# Altium project PAY_IF.PrjPcb (part 1 of 3)
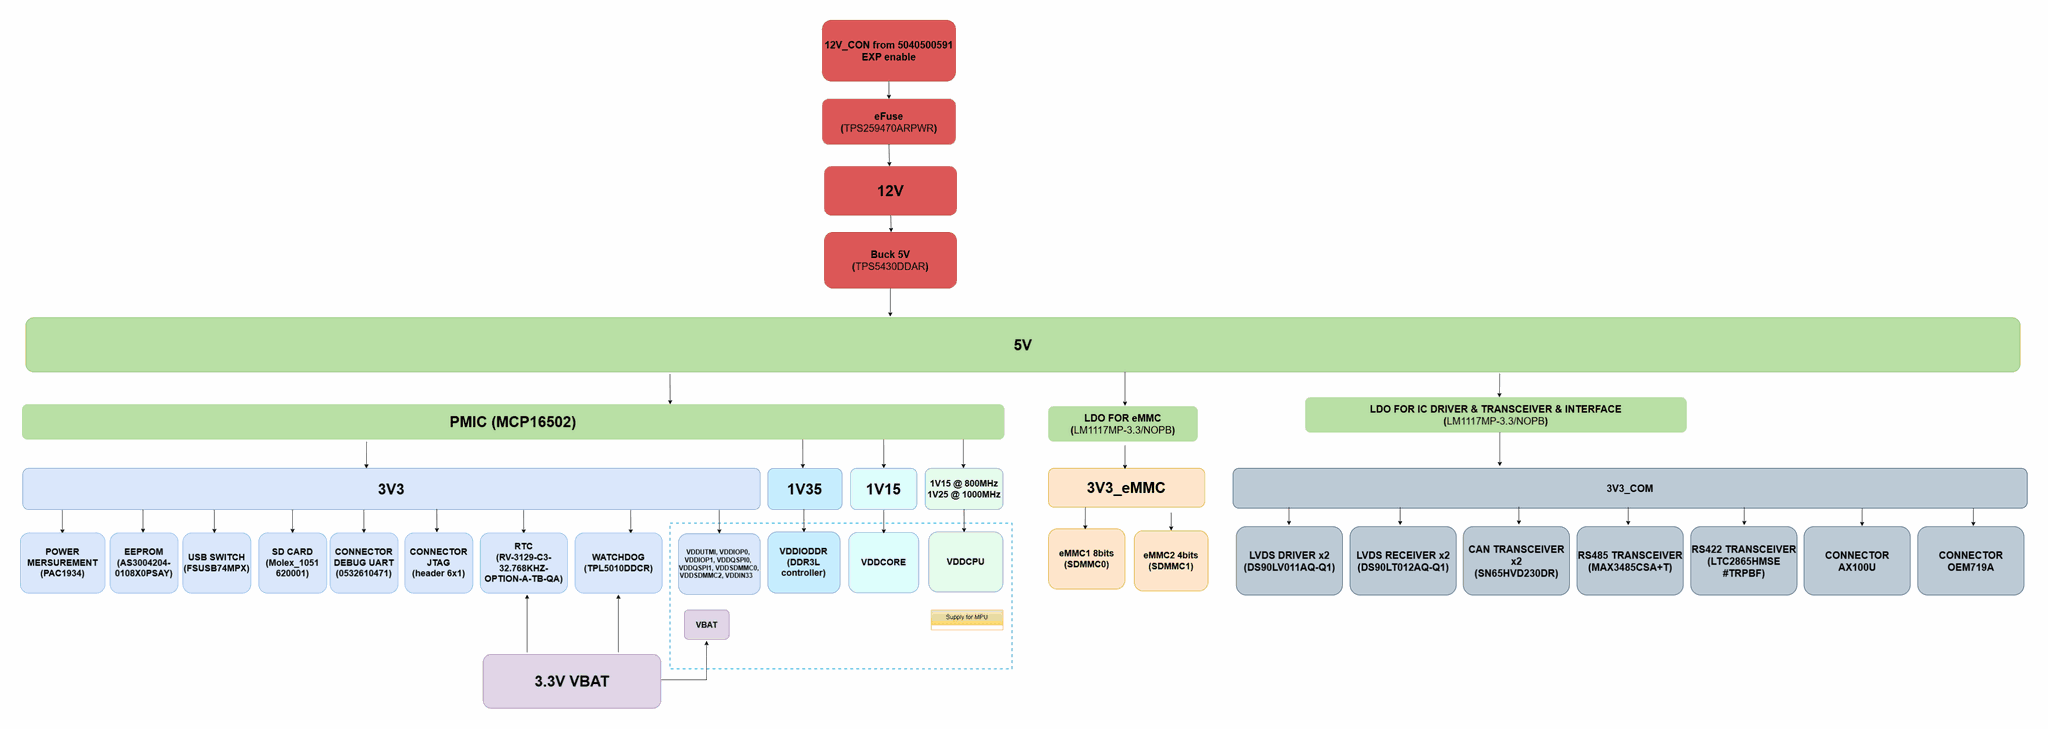
[diagram p0: PowerTree.SchDoc]
21 sheets, 538 parts. Net scope: flat (ports and power ports of the same name join across sheets).
Board file: BEE-1012 PAY-IF V1.0.0.PcbDoc
Sheets:
  PowerTree.SchDoc
  Power.SchDoc
  CONNECTOR_EXP.SchDoc
  CONNECTOR_INTERFACE.SchDoc
  SAMA7D65_PMIC.SchDoc
  SAMA7D65_MPU.SchDoc
  SAMA7D65_PIO.SchDoc
  SAMA7D65_DDR3L.SchDoc
  SDCARD.SchDoc
  eMMC.SchDoc
  EEPROM.SchDoc
  USB_SWITCH.SchDoc
  DEBUG_CONSOLE.SchDoc
  TEMP.SchDoc
  RTC.SchDoc
  WATCHDOG.SchDoc
  LVDS.SchDoc
  CAN_PHY.SchDoc
  RS422.SchDoc
  BUTTON_LED.SchDoc
  MOUNTING_HOLE.SchDoc

## Sheet PowerTree.SchDoc
size 420 x 297 mm; SheetNumber: 1; SheetTotal: 23

### Notes on the sheet
- Project:
- BEE-1012
- Sub-system:
- SATELLITE_EXP_CONTROLLER
- Design by:
- SANG HUYNH
- BAO BUI
- Sheet title:
- Sheet
- A3
- of
- Checked by:
- Approved by:
- VU PHAM
- Revision:
- Document No:
- Size:
- Date:

## Sheet Power.SchDoc
size A3; SheetNumber: 3; SheetTotal: 23
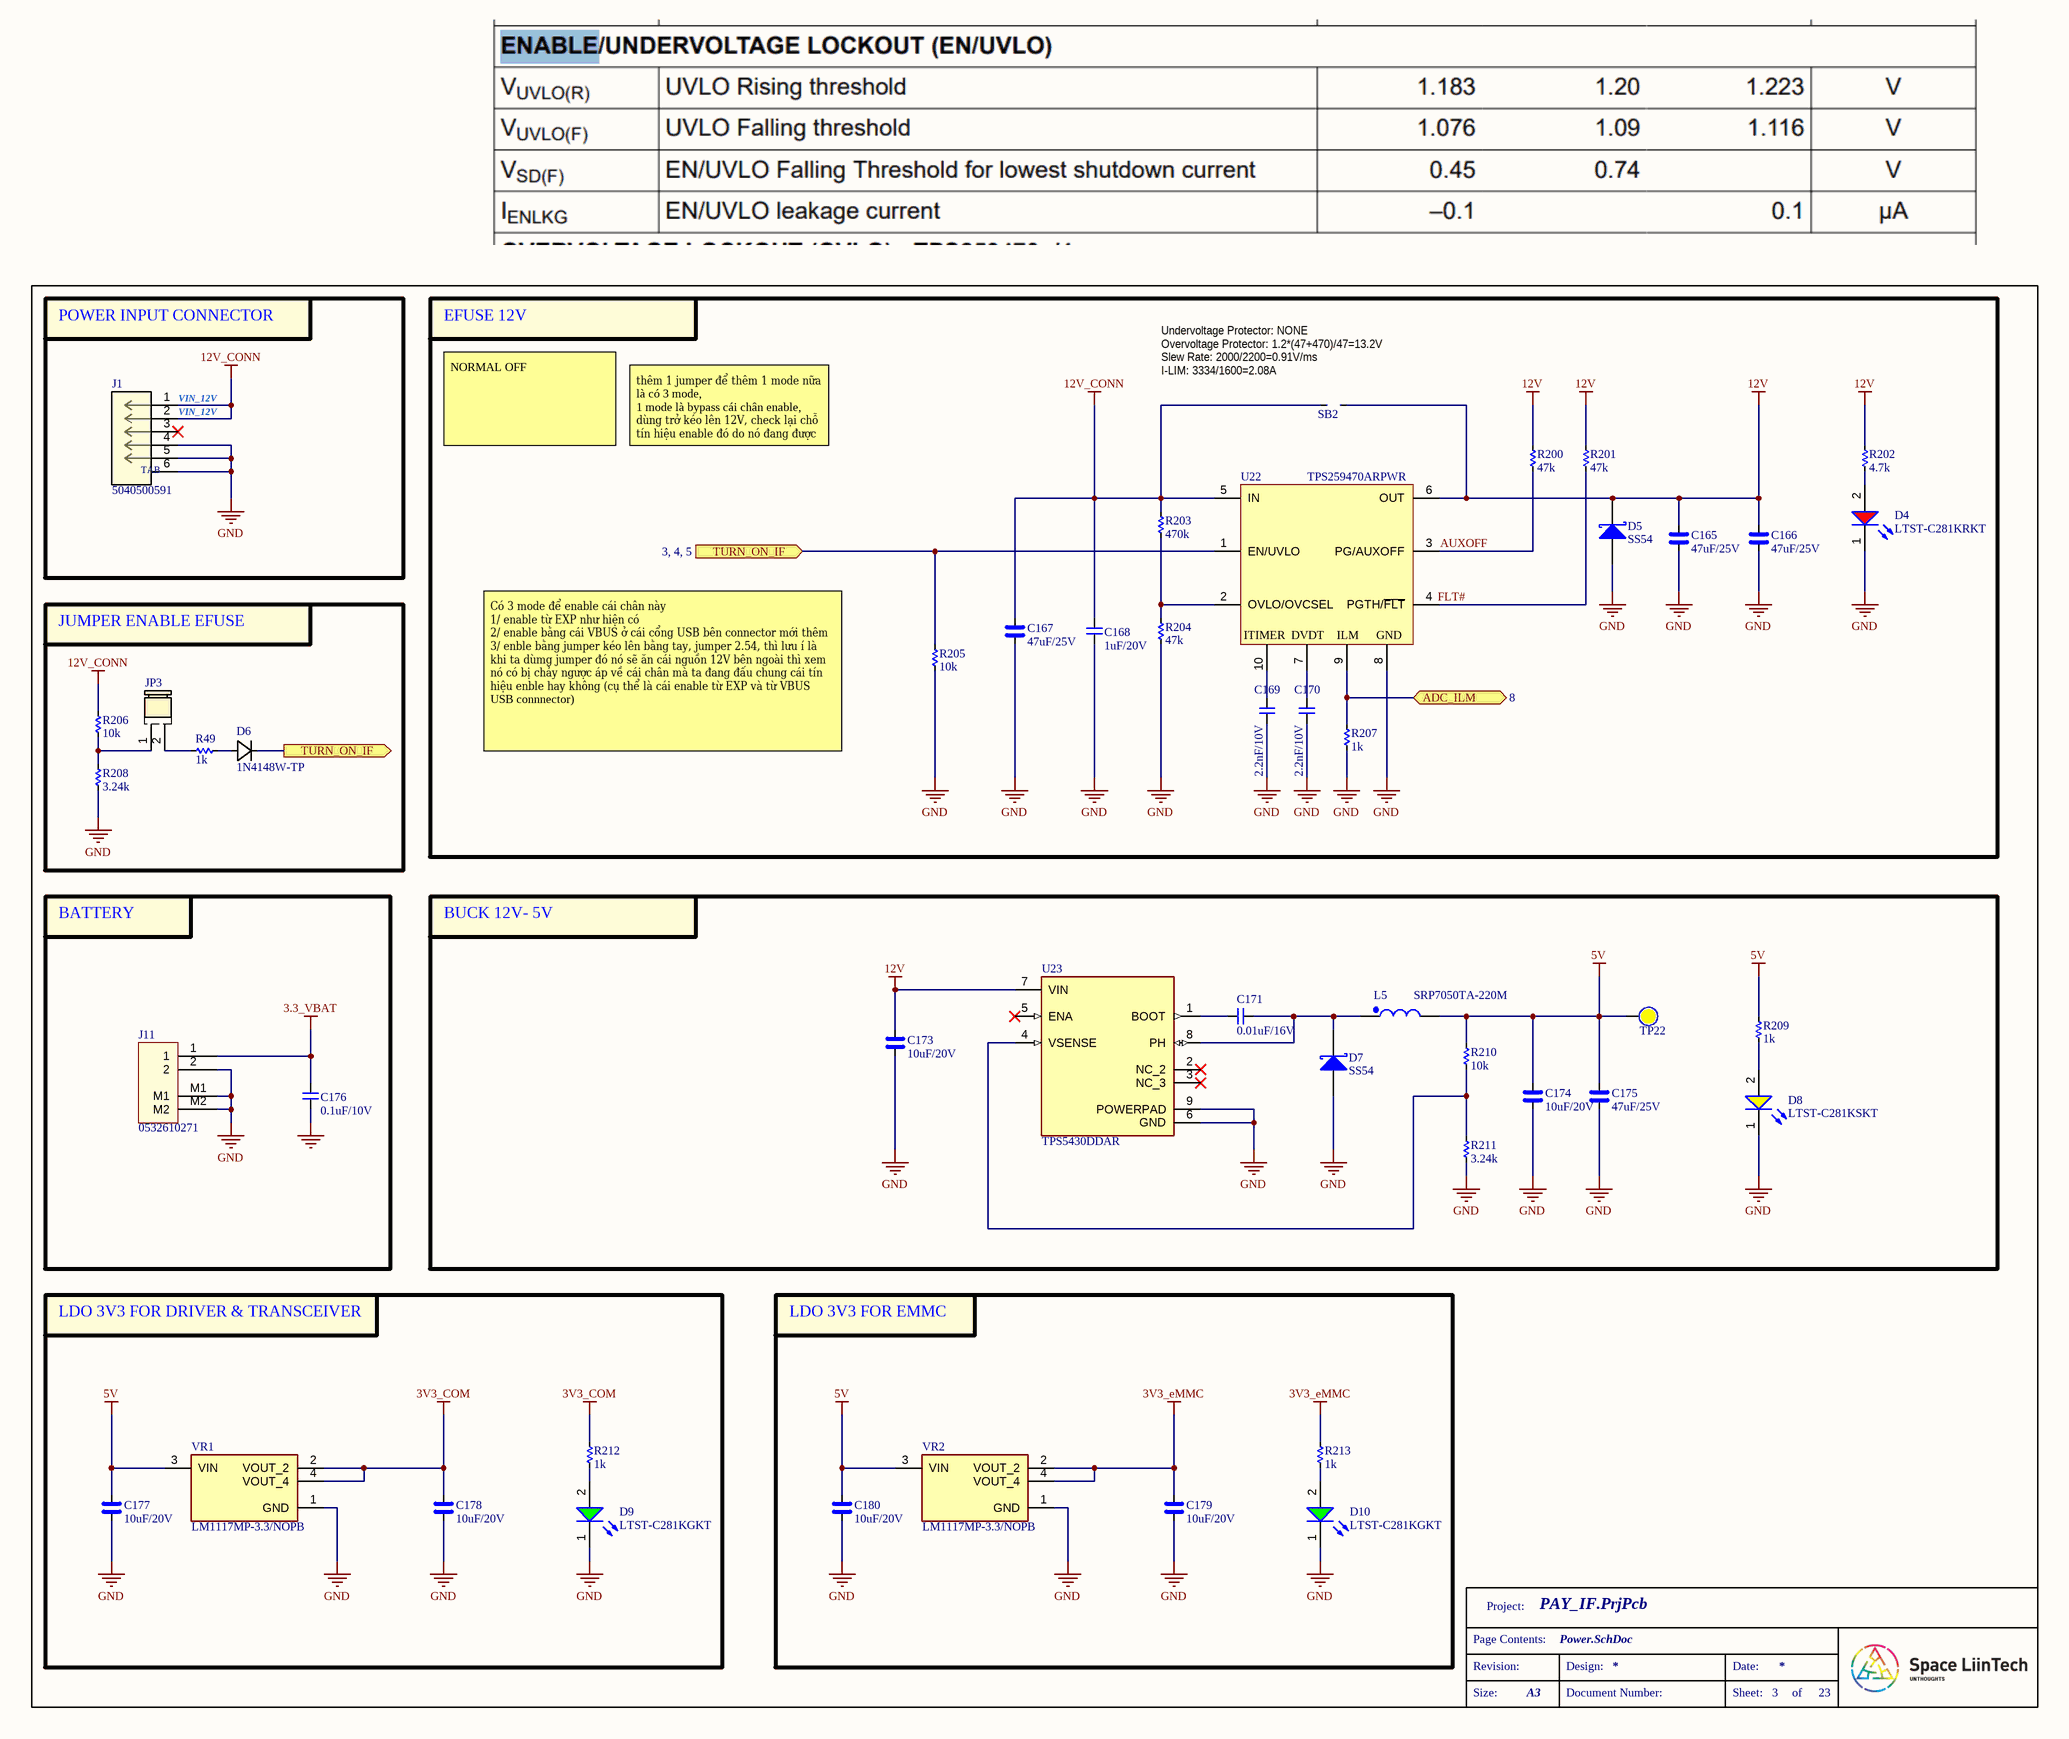
[diagram p1: Power.SchDoc]

### Parts
(Parts that share a designator on the sheet are numbered #1, #2 ... from top to bottom, then left to right.)
C165  47uF/25V  [CAP_C_3225X80]
C166  47uF/25V  [CAP_C_3225X80]
C167  47uF/25V  [CAP_C_3225X80]
C168  1uF/20V  [CAP_C_1005X50_L]
C169  2.2nF/10V  [CAP_C_1005X50_L]
C170  2.2nF/10V  [CAP_C_1005X50_L]
C171  0.01uF/16V  [CAP_C_1608X80_L]
C173  10uF/20V  [CAP_C_2012X110]
C174  10uF/20V  [CAP_C_2012X110]
C175  47uF/25V  [CAP_C_3225X80]
C176  0.1uF/10V  [CAP_C_1005X50_L]
C177  10uF/20V  [CAP_C_2012X110]
C178  10uF/20V  [CAP_C_2012X110]
C179  10uF/20V  [CAP_C_2012X110]
C180  10uF/20V  [CAP_C_2012X110]
D4  LTST-C281KRKT  [LED_0402]
D5  SS54  [DO-214AC_SMA]
D6#1  1N4148W-TP  [SOD123_MCC]
D7  SS54  [DO-214AC_SMA]
D8  LTST-C281KSKT  [LED_0402]
D9  LTST-C281KGKT  [LED_0402]
D10  LTST-C281KGKT  [LED_0402]
J1  5040500591  [5040500591]
J11#1  0532610271  [MOLEX_0532610271]
JP3  JUMPER_254P_NOPLACE  [JUMPER_254P_2X1_ANGLE]  (value not drawn)
L5  SRP7050TA-220M  [SRP7050TA-220M]
R49  1k  [RES_C_1005x30_L]
R200  47k  [RES_C_1005x30_L]
R201  47k  [RES_C_1005x30_L]
R202  4.7k  [RES_C_1005x30_L]
R203  470k  [RES_C_1005x30_L]
R204  47k  [RES_C_1005x30_L]
R205  10k  [RES_C_1005x30_L]
R206  10k  [RES_C_1005x30_L]
R207  1k  [RES_C_1005x30_L]
R208  3.24k  [RES_C_1005x30_L]
R209  1k  [RES_C_1005x30_L]
R210  10k  [RES_C_1005x30_L]
R211  3.24k  [RES_C_1005x30_L]
R212  1k  [RES_C_1005x30_L]
R213  1k  [RES_C_1005x30_L]
SB2  JUMPER  [JUMPER_1608]  (value not drawn)
TP22  (no value)  [Test point]  (no BOM)
U22  TPS259470ARPWR  [VQFN-HR-10]
U23  TPS5430DDAR  [CONV_TPS5430DDAR]
VR1  LM1117MP-3.3/NOPB  [VREG_LM1117MP-3.3/NOPB]
VR2  LM1117MP-3.3/NOPB  [VREG_LM1117MP-3.3/NOPB]

### Blocks framed on the sheet
POWER INPUT CONNECTOR: J1
EFUSE 12V: C165-C170 D4 D5 R200-R205 R207 SB2 U22
JUMPER ENABLE EFUSE: D6#1 JP3 R49 R206 R208
BATTERY: C176 J11#1
BUCK 12V- 5V: C171 C173-C175 D7 D8 L5 R209-R211 TP22 U23
LDO 3V3 FOR DRIVER & TRANSCEIVER: C177 C178 D9 R212 VR1
LDO 3V3 FOR EMMC: C179 C180 D10 R213 VR2

### Ports
ADC_ILM (bidir, see 8), TURN_ON_IF (in, see 3, 4, 5), TURN_ON_IF (out, see 3, 4, 5)

### Nets
3.3_VBAT: C176.1 J11#1.1
3V3_COM: C178.2 R212.2 VR1.2(VOUT_2) VR1.4(VOUT_4)
3V3_eMMC: C179.2 R213.2 VR2.2(VOUT_2) VR2.4(VOUT_4)
5V: C174.2 C175.2 C177.2 C180.2 L5.2 R209.2 R210.1 TP22.0 VR1.3(VIN) VR2.3(VIN)
12V: C165.2 C166.2 C173.2 D5.1(K) R200.2 R201.2 R202.2 SB2.2 U22.6(OUT) U23.7(VIN)
12V_CONN: C167.2 C168.2 J1.1 J1.2 R203.1 R206.2 SB2.1 U22.5(IN)
GND: C165.1 C166.1 C167.1 C168.1 C169.1 C170.1 C173.1 C174.1 C175.1 C176.2 C177.1 C178.1 C179.1 C180.1 D4.1(K) D5.2(A) D7.2(A) D8.1(K) D9.1(K) D10.1(K) J1.4 J1.5 J1.6 J11#1.2 J11#1.M1 J11#1.M2 R204.2 R205.2 R207.2 R208.2 R211.2 U22.8(GND) U23.6(GND) U23.9(POWERPAD) VR1.1(GND) VR2.1(GND)
AUXOFF: R200.1 U22.3(PG/AUXOFF)
FLT#: R201.1 U22.4(PGTH/~{FLT})
NetC169_2: C169.2 U22.10(ITIMER)
NetC170_2: C170.2 U22.7(DVDT)
NetC171_1: C171.1 D7.1(K) L5.1 U23.8(PH)
NetC171_2: C171.2 U23.1(BOOT)
NetD4_2: D4.2(A) R202.1
NetD6#1_1: D6#1.1 R205.1 U22.1(EN/UVLO) ; port TURN_ON_IF
NetD6#1_2: D6#1.2 R49.2
NetD8_2: D8.2(A) R209.1
NetD9_2: D9.2(A) R212.1
NetD10_2: D10.2(A) R213.1
NetJP3_1: JP3.1 R206.1 R208.1
NetJP3_2: JP3.2 R49.1
NetR88_2: R207.1 U22.9(ILM) ; port ADC_ILM
NetR203_2: R203.2 R204.1 U22.2(OVLO/OVCSEL)
NetR210_2: R210.2 R211.1 U23.4(VSENSE)

Not connected (* = marked no-connect by the designer): J1 3*; U23 2(NC_2)* 3(NC_3)* 5(ENA)*

### Notes on the sheet
- Undervoltage Protector: NONE
- Overvoltage Protector: 1.2*(47+470)/47=13.2V
- (near SB2) Slew Rate: 2000/2200=0.91V/ms
- (near J1) VIN_12V
- (near SB2) I-LIM: 3334/1600=2.08A
- NORMAL OFF
- thêm 1 jumper để thêm 1 mode nữa là có 3 mode,
  1 mode là bypass cái chân enable, dùng trở kéo lên 12V, check lại chỗ tín hiệu enable đó do nó đang được enable bởi EXP và cái VBUS bên connector
- Có 3 mode để enable cái chân này
  1/ enable từ EXP như hiện có
  2/ enable bằng cái VBUS ở cái cổng USB bên connector mới thêm
  3/ enble bằng jumper kéo lên bằng tay, jumper 2.54, thì lưu í là khi ta dùmg jumper đó nó sẽ ăn cái nguồn 12V bên ngoài thì xem nó có bị chảy ngược áp về cái chân mà ta đang đấu chung cái tín hiệu enble hay không (cụ thể là cái enable từ EXP và từ VBUS USB connnector)
- Project:
- Page Contents:
- Revision:
- Design:
- Date:
- Size:
- A3
- Document Number:
- Sheet:
- of
- (in symbol 5040500591) TAB

### Library data of the parts
C165-C167 C173-C175 C177-C180 = _CAP_C_High_2: CAP CHIP High Value
C168-C171 C176 = _CAP_C_2: CAP CHIP
D4 = LED_RED: LED RED CLEAR 0402 SMD
D5 D7 = SS54: DIODE SCHOTTKY 40V 5A SMA; MPN: SS34; Solder: SMT; Value: SS34; MFR: *
D6#1 = 1N4148W-TP: Description; Manufacturer_Name: MCC; Copyright: Copyright (C) 2026 Ultra Librarian. All rights reserved.; Manufacturer_Part_Number: 1N4148W-TP
D8 = LED_YELLOW: LED YELLOW CLEAR 0402 SMD
D9 D10 = LED_GREEN: LED GREEN CLEAR 0402 SMD
J1 = 5040500591: 1.50mm Pitch, Pico-Lock PCB Header, Single Row, Right-Angle, Surface Mount, Gold (Au) Plating, Positive Lock, 5 Circuits, Tape and Reel; Manufacturer_Name: Molex Connector Corporation; Copyright: Copyright (C) 2025 Ultra Librarian. All rights reserved.; Manufacturer_Part_Number: 5040500591; RefDes: RefDes; Type: Type
J11#1 = Header 2x1_2M
L5 = _IND: FIXED IND 22UH 2.5A 170 MOHM SMD
R49 R200-R213 = _RES_B_2: RES
TP22 = Test Point: Solder: NF
U23 = TPS5430DDAR: 5.5V to 36V Input, 3A, 500kHz Step-Down Converter; MF: Texas Instruments; Package: HSOIC-8 Texas Instruments; Check_prices: https://www.snapeda.com/parts/TPS5430DDAR/Texas+Instruments/view-part/?ref=eda; Value: *; Purchase-URL: https://pricing.snapeda.com/search/part/TPS5430DDAR/?ref=eda; Availability: In Stock; SnapEDA_Link: https://www.snapeda.com/parts/TPS5430DDAR/Texas+Instruments/view-part/?ref=snap; MP: TPS5430DDAR; Price: None
VR1 VR2 = LM1117MP-3.3/NOPB: 800-mA 15-V linear voltage regulator; MF: Texas Instruments; SnapEDA_Link: https://www.snapeda.com/parts/LM1117MP-3.3/NOPB/Texas+Instruments/view-part/?ref=snap; Package: SOT-223-4 Texas Instruments; Value: *; MP: LM1117MP-3.3/NOPB; Check_prices: https://www.snapeda.com/parts/LM1117MP-3.3/NOPB/Texas+Instruments/view-part/?ref=eda

## Sheet CONNECTOR_EXP.SchDoc
size A3; SheetNumber: 4; SheetTotal: 23
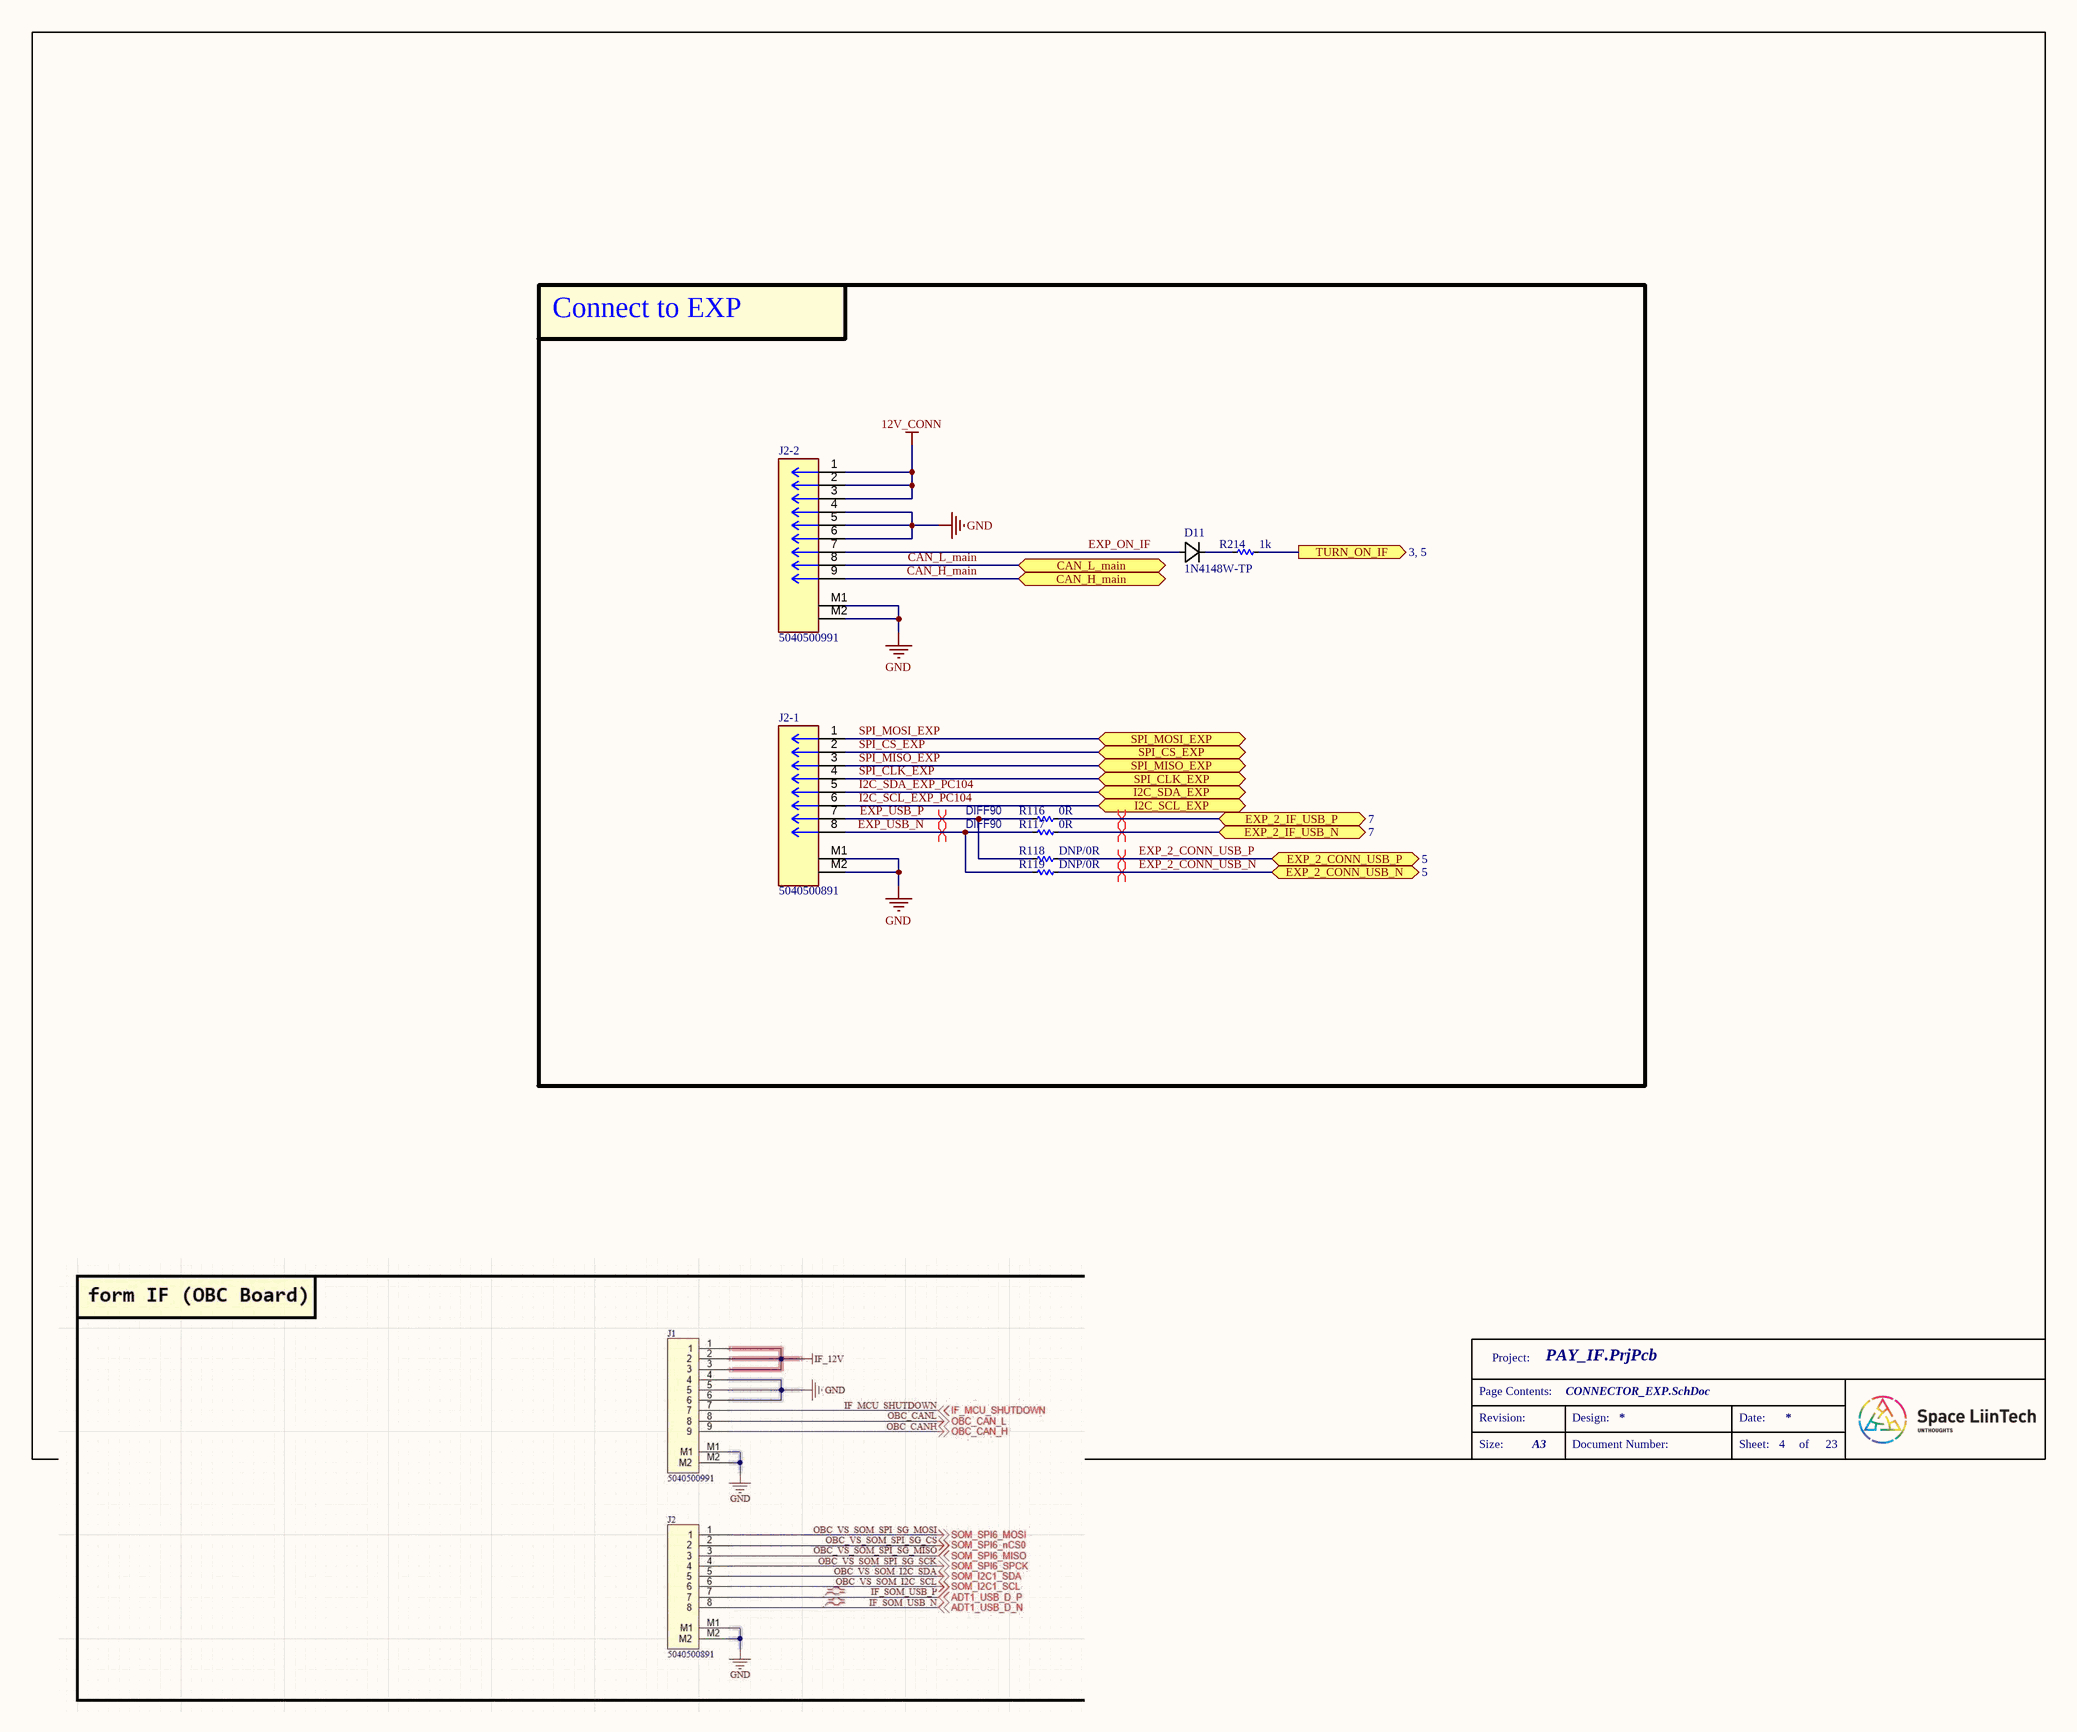
[diagram p2: CONNECTOR_EXP.SchDoc]

### Parts
D11  1N4148W-TP  [SOD123_MCC]
J2-1  5040500891  [MOLEX_5040500891]
J2-2  5040500991  [MOLEX_5040500991]
R116  0R  [RES_C_0603X30]
R117  0R  [RES_C_0603X30]
R118  DNP/0R  [RES_C_0603X30]
R119  DNP/0R  [RES_C_0603X30]
R214  1k  [RES_C_1005x30_L]

### Blocks framed on the sheet
Connect to EXP: D11 J2-1 J2-2 R116-R119 R214

### Ports
CAN_H_main (bidir, see 5, 19), CAN_L_main (bidir, see 5, 19), EXP_2_CONN_USB_N (bidir, see 5), EXP_2_CONN_USB_P (bidir, see 5), EXP_2_IF_USB_N (bidir, see 7), EXP_2_IF_USB_P (bidir, see 7), I2C_SCL_EXP (bidir, see 5, 8), I2C_SDA_EXP (bidir, see 5, 8), SPI_CLK_EXP (bidir, see 5), SPI_CS_EXP (bidir, see 5), SPI_MISO_EXP (bidir, see 5), SPI_MOSI_EXP (bidir, see 5), TURN_ON_IF (out, see 3, 5)

### Nets
12V_CONN: J2-2.1 J2-2.2 J2-2.3
GND: J2-1.M1 J2-1.M2 J2-2.4 J2-2.5 J2-2.6 J2-2.M1 J2-2.M2
CAN_H_main: J2-2.9 ; port CAN_H_main  [project net CAN_A7_H]
CAN_L_main: J2-2.8 ; port CAN_L_main  [project net CAN_A7_L]
EXP_2_CONN_USB_N: R119.2 ; port EXP_2_CONN_USB_N
EXP_2_CONN_USB_P: R118.2 ; port EXP_2_CONN_USB_P
EXP_2_IF_USB_N: R117.2 ; port EXP_2_IF_USB_N
EXP_2_IF_USB_P: R116.2 ; port EXP_2_IF_USB_P
EXP_ON_IF: D11.2 J2-2.7
EXP_USB_N: J2-1.8 R117.1 R119.1
EXP_USB_P: J2-1.7 R116.1 R118.1
I2C_SCL_EXP_PC104: J2-1.6 ; port I2C_SCL_EXP  [project net FLEXCOM1_I2C_SCL]
I2C_SDA_EXP_PC104: J2-1.5 ; port I2C_SDA_EXP  [project net FLEXCOM1_I2C_SDA]
SPI_CLK_EXP: J2-1.4 ; port SPI_CLK_EXP
SPI_CS_EXP: J2-1.2 ; port SPI_CS_EXP
SPI_MISO_EXP: J2-1.3 ; port SPI_MISO_EXP
SPI_MOSI_EXP: J2-1.1 ; port SPI_MOSI_EXP
NetD6#1_1: R214.2 ; port TURN_ON_IF
NetD11_1: D11.1 R214.1

### Layout directives
differential pair; differential pair class DIFF90; net class DIFF90; rule Matched Net Lengths [Tolerance = 4mil]: EXP_2_CONN_USB_N, EXP_2_CONN_USB_P, EXP_2_IF_USB_N, EXP_2_IF_USB_P, EXP_USB_N, EXP_USB_P

### Notes on the sheet
- Project:
- Page Contents:
- Revision:
- Design:
- Date:
- Size:
- A3
- Document Number:
- Sheet:
- of

### Library data of the parts
D11 = 1N4148W-TP: Description; Manufacturer_Name: MCC; Copyright: Copyright (C) 2026 Ultra Librarian. All rights reserved.; Manufacturer_Part_Number: 1N4148W-TP
J2-1 = 5040500891: Connector Header Surface Mount, Right Angle 8 position 0.059" (1.50mm)`
J2-2 = 5040500991: Connector Header Surface Mount, Right Angle 9 position 0.059" (1.50mm)
R116-R119 R214 = _RES_B_2: RES

## Sheet CONNECTOR_INTERFACE.SchDoc
size A3; SheetNumber: 5; SheetTotal: 23
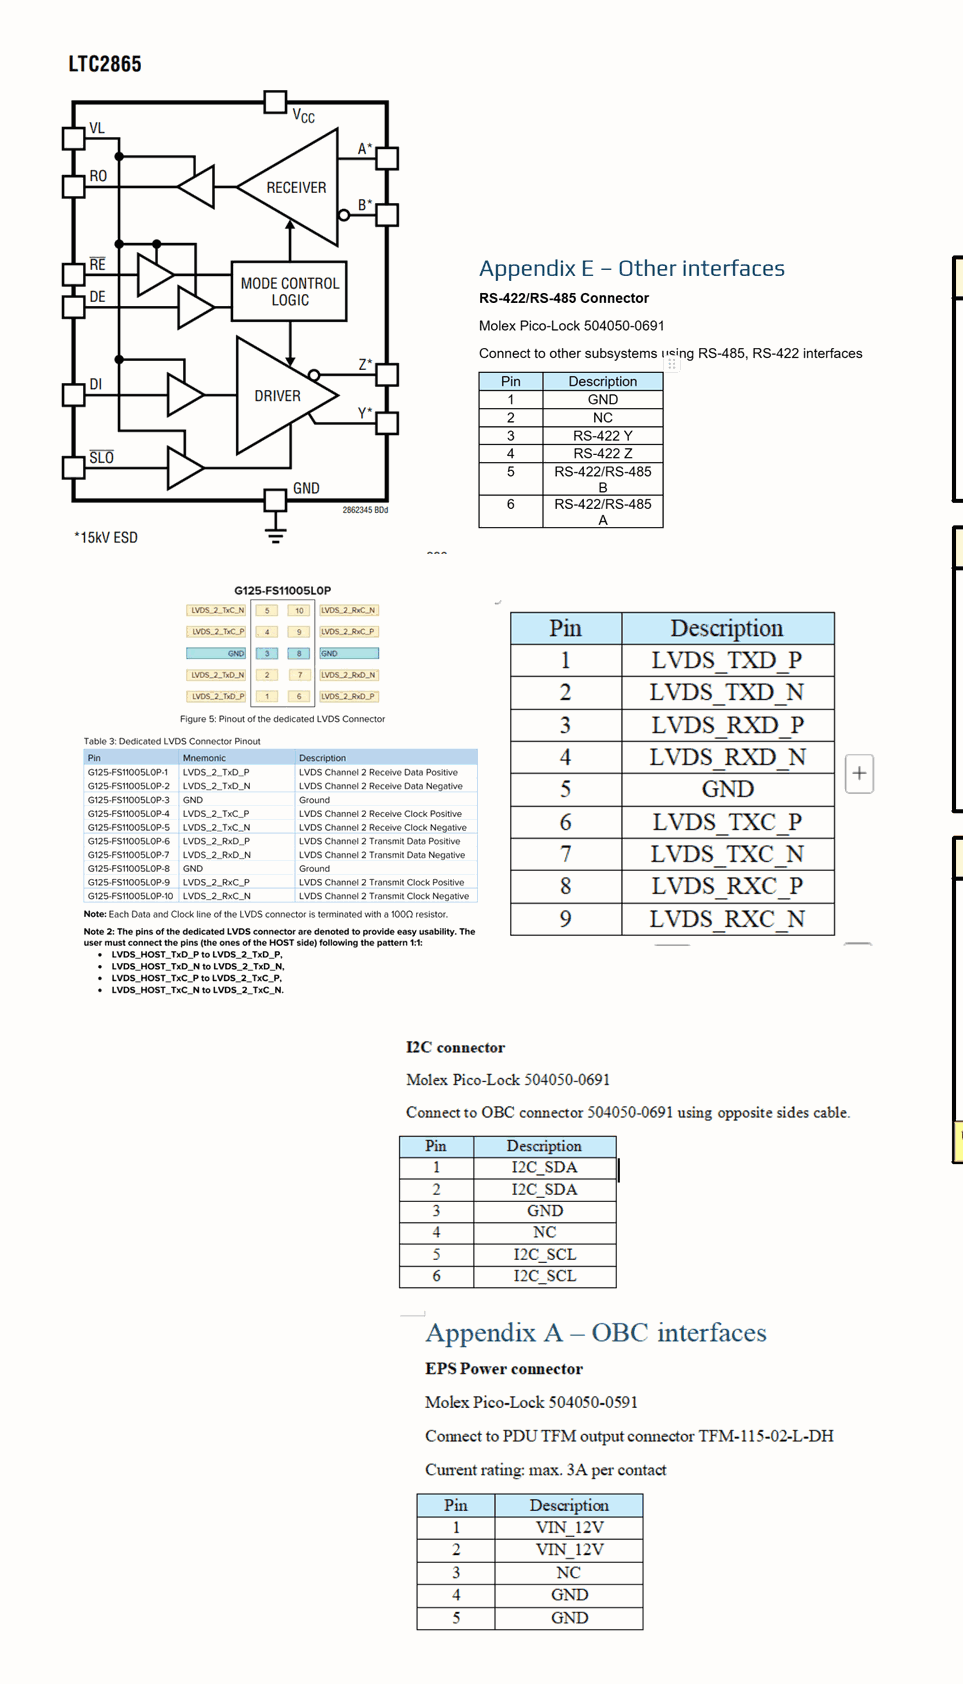
[diagram p3: CONNECTOR_INTERFACE.SchDoc, left]
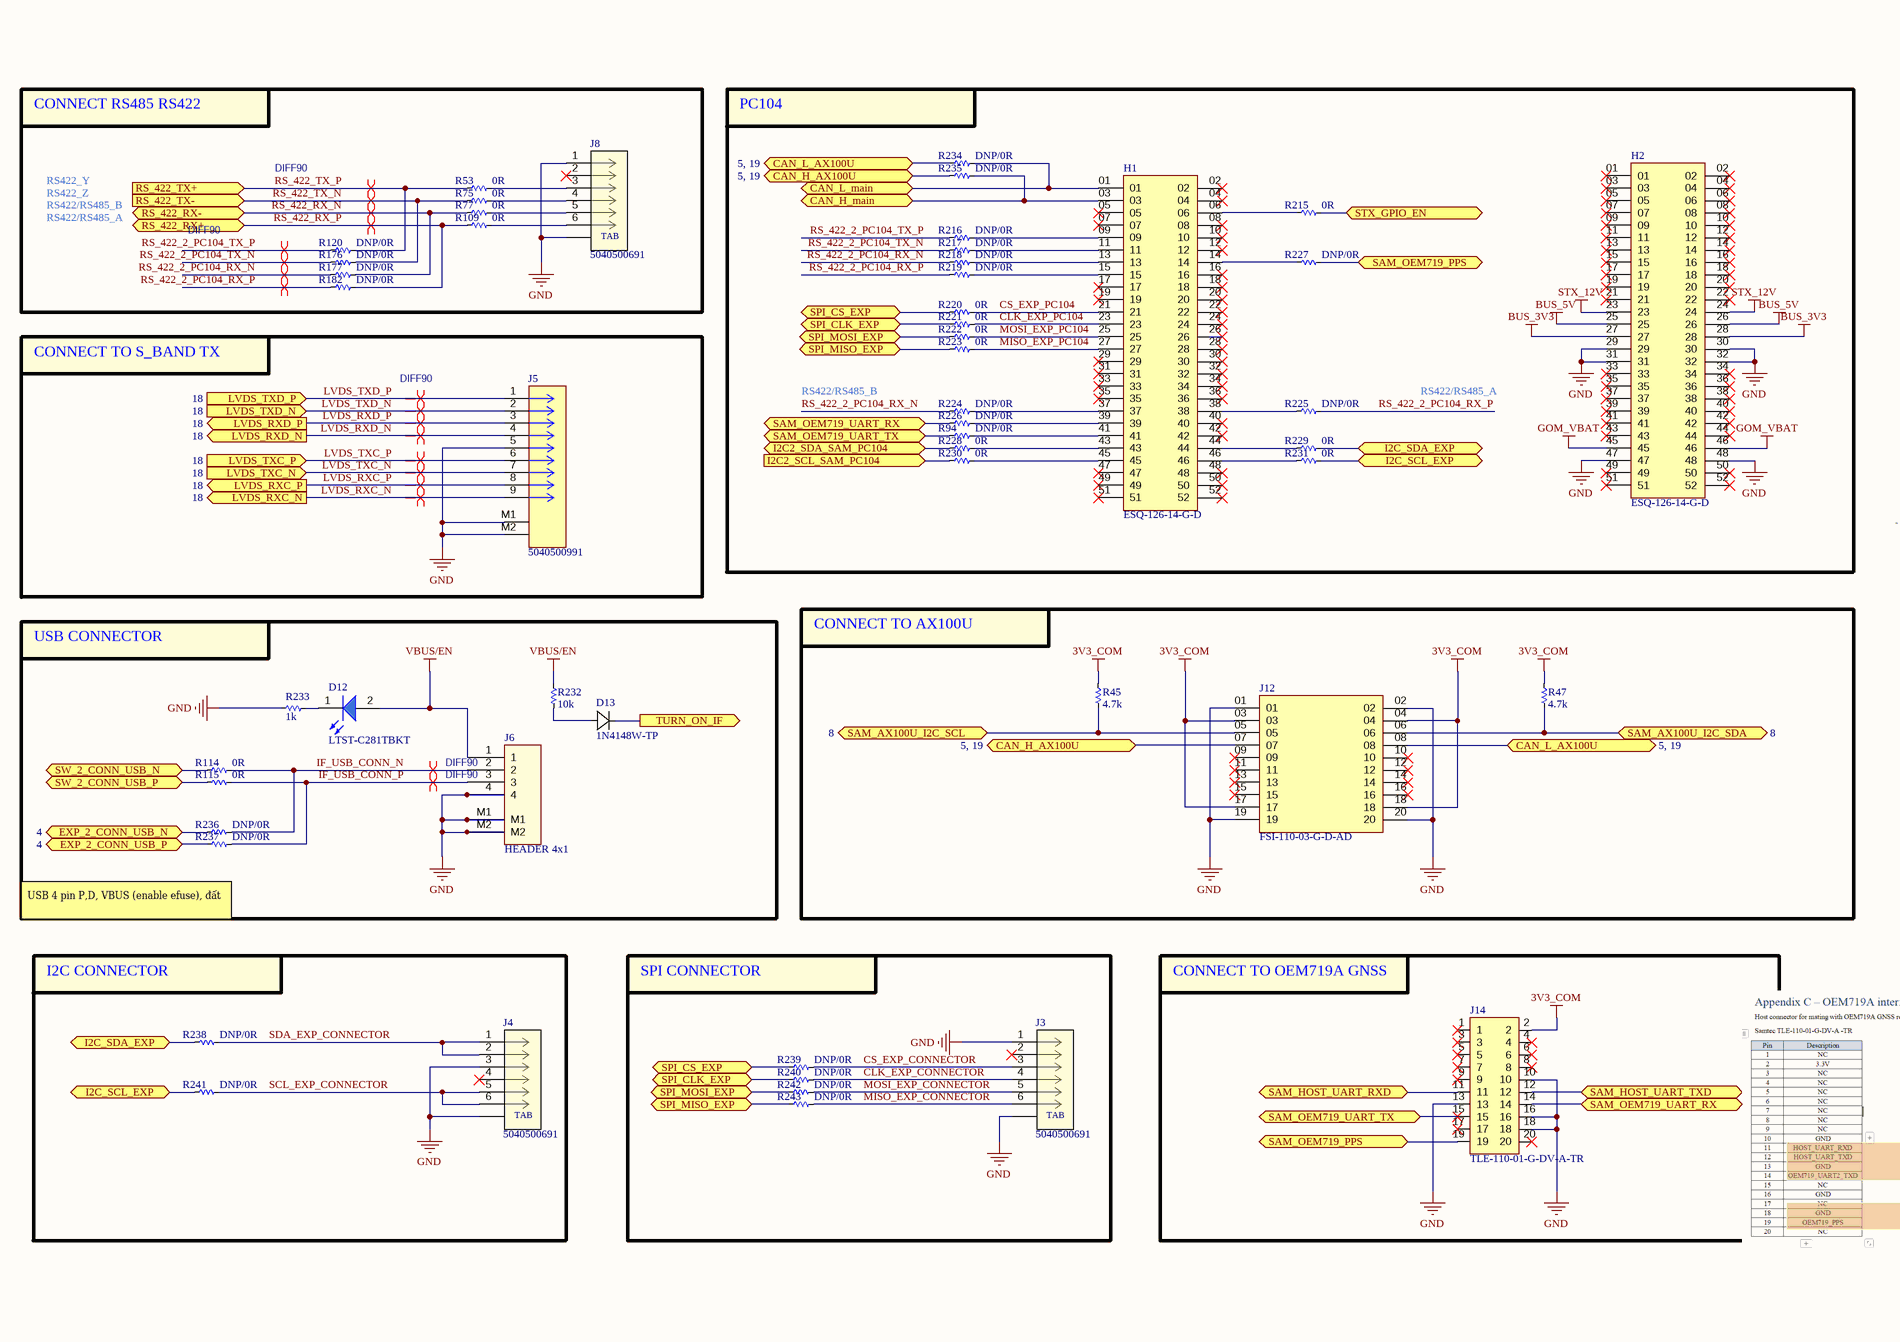
[diagram p4: CONNECTOR_INTERFACE.SchDoc, middle]
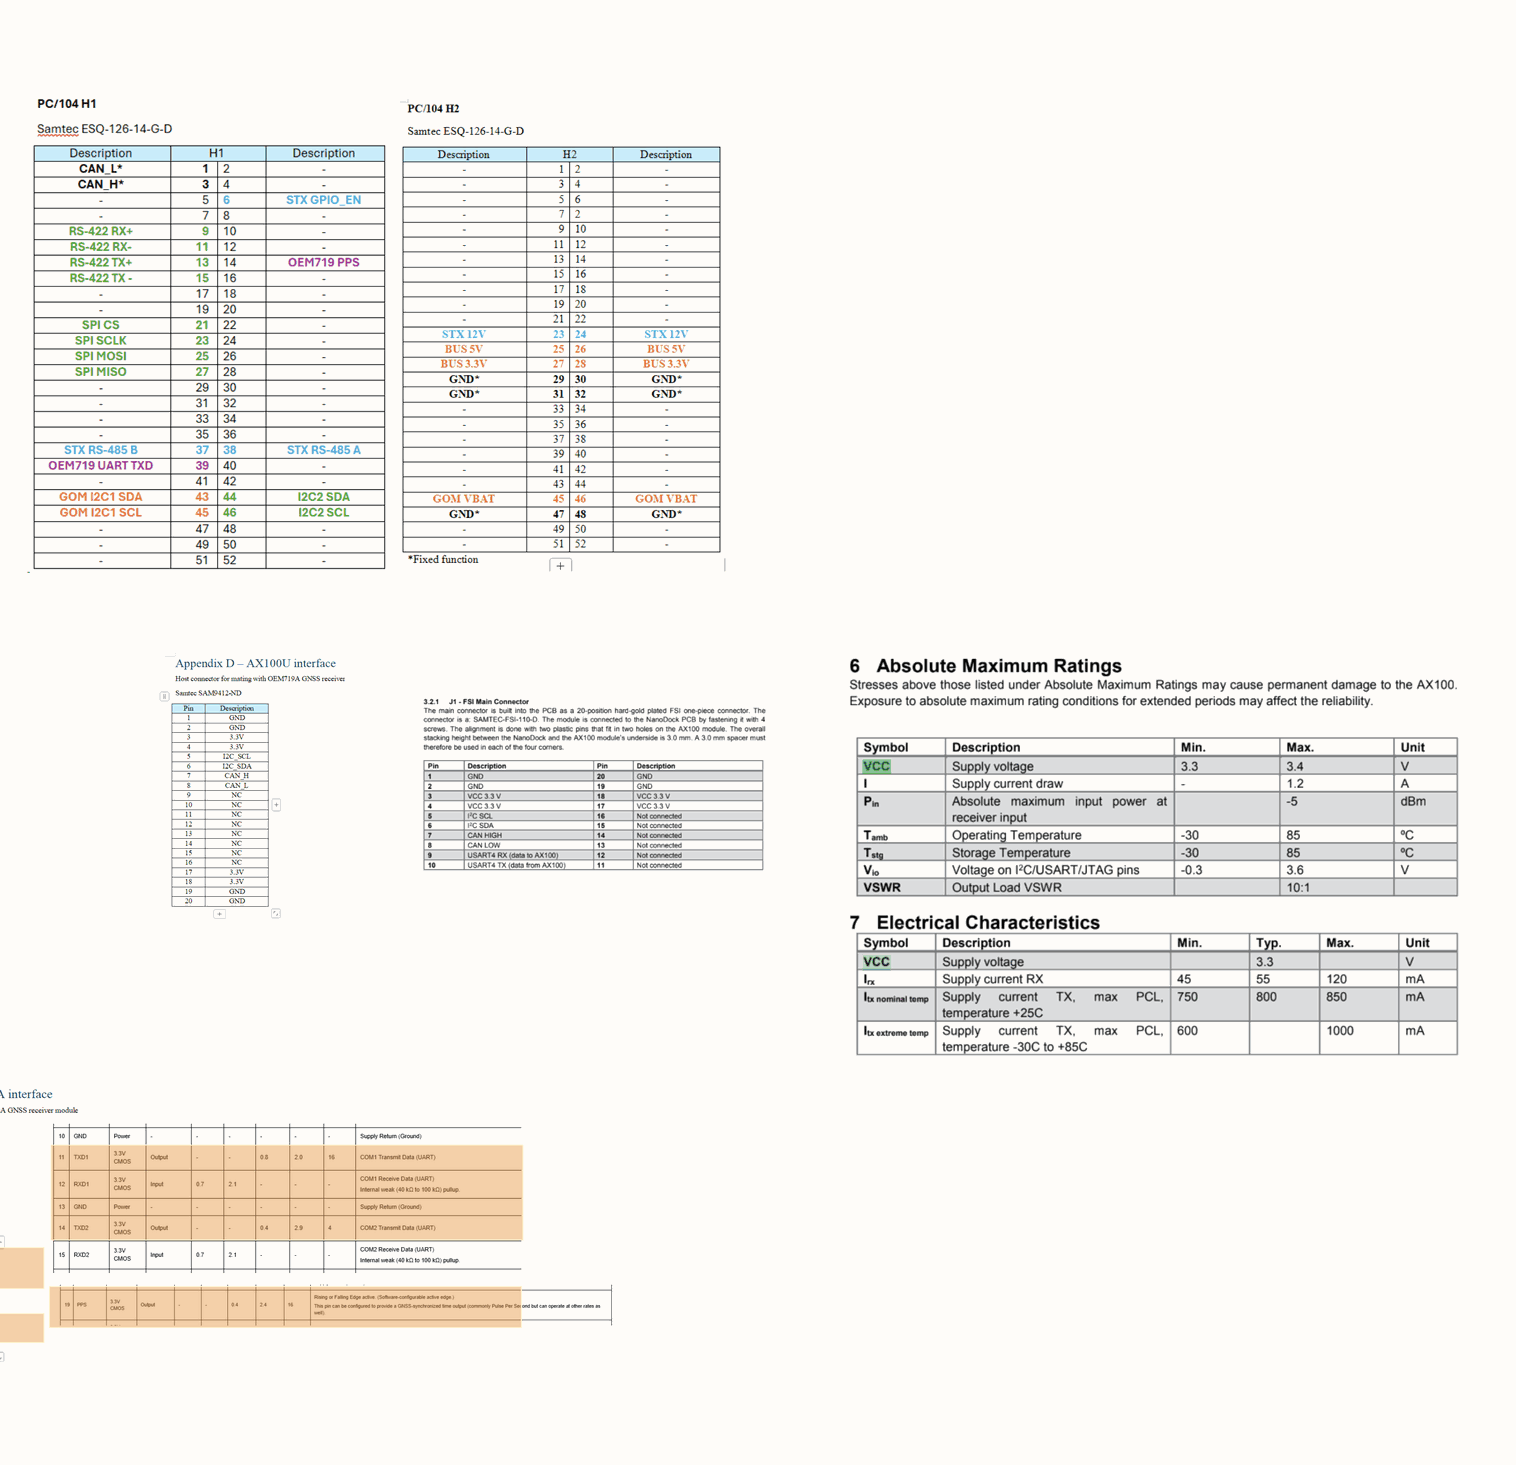
[diagram p5: CONNECTOR_INTERFACE.SchDoc, right]

### Parts
(Parts that share a designator on the sheet are numbered #1, #2 ... from top to bottom, then left to right.)
D12  LTST-C281TBKT  [LED_0402]
D13  1N4148W-TP  [SOD123_MCC]
H1  ESQ-126-14-G-D  [SAMTEC_ESQ-126-14-G-D]
H2  ESQ-126-14-G-D  [SAMTEC_ESQ-126-14-G-D]
J3  5040500691  [5040500691]
J4  5040500691  [5040500691]
J5  5040500991  [5040500991]
J6  HEADER 4x1  [MOLEX_5040500491]
J8  5040500691  [5040500691]
J12  FSI-110-03-G-D-AD  [SAMTEC_FSI-110-03-X-D-AD-TR]
J14#1  TLE-110-01-G-DV-A-TR  [SAMTEC-TLE-110-01-X-DV-A]
R45  4.7k  [RES_C_1005x30_L]
R47  4.7k  [RES_C_1005x30_L]
R53  0R  [RES_C_1005x30_L]
R75  0R  [RES_C_1005x30_L]
R77  0R  [RES_C_1005x30_L]
R94  DNP/0R  [RES_C_1005x30_L]
R109  0R  [RES_C_1005x30_L]
R114  0R  [RES_C_0603X30]
R115  0R  [RES_C_0603X30]
R120  DNP/0R  [RES_C_1005x30_L]
R176  DNP/0R  [RES_C_1005x30_L]
R177  DNP/0R  [RES_C_1005x30_L]
R182  DNP/0R  [RES_C_1005x30_L]
R215  0R  [RES_C_1005x30_L]
R216  DNP/0R  [RES_C_1005x30_L]
R217  DNP/0R  [RES_C_1005x30_L]
R218  DNP/0R  [RES_C_1005x30_L]
R219  DNP/0R  [RES_C_1005x30_L]
R220  0R  [RES_C_1005x30_L]
R221  0R  [RES_C_1005x30_L]
R222  0R  [RES_C_1005x30_L]
R223  0R  [RES_C_1005x30_L]
R224  DNP/0R  [RES_C_1005x30_L]
R225  DNP/0R  [RES_C_1005x30_L]
R226  DNP/0R  [RES_C_1005x30_L]
R227  DNP/0R  [RES_C_1005x30_L]
R228  0R  [RES_C_1005x30_L]
R229  0R  [RES_C_1005x30_L]
R230  0R  [RES_C_1005x30_L]
R231  0R  [RES_C_1005x30_L]
R232  10k  [RES_C_1005x30_L]
R233  1k  [RES_C_1005x30_L]
R234  DNP/0R  [RES_C_1005x30_L]
R235  DNP/0R  [RES_C_1005x30_L]
R236  DNP/0R  [RES_C_0603X30]
R237  DNP/0R  [RES_C_0603X30]
R238  DNP/0R  [RES_C_1005x30_L]
R239  DNP/0R  [RES_C_1005x30_L]
R240  DNP/0R  [RES_C_1005x30_L]
R241  DNP/0R  [RES_C_1005x30_L]
R242  DNP/0R  [RES_C_1005x30_L]
R243  DNP/0R  [RES_C_1005x30_L]

### Blocks framed on the sheet
CONNECT RS485 RS422: J8 R53 R75 R77 R109 R120 R176 R177 R182
PC104: H1 H2 R94 R215-R231 R234 R235
CONNECT TO S_BAND TX: J5
USB CONNECTOR: D12 D13 J6 R114 R115 R232 R233 R236 R237
CONNECT TO AX100U: J12 R45 R47
I2C CONNECTOR: J4 R238 R241
SPI CONNECTOR: J3 R239 R240 R242 R243
CONNECT TO OEM719A GNSS: J14#1

### Ports
CAN_H_AX100U (bidir, see 5, 19), CAN_H_main (bidir, see 4, 19), CAN_L_AX100U (bidir, see 5, 19), CAN_L_main (bidir, see 4, 19), EXP_2_CONN_USB_N (bidir, see 4), EXP_2_CONN_USB_P (bidir, see 4), I2C2_SCL_SAM_PC104 (in, see 8), I2C2_SDA_SAM_PC104 (bidir, see 8), I2C_SCL_EXP (bidir, see 4, 5, 8), I2C_SDA_EXP (bidir, see 4, 5, 8), LVDS_RXC_N (out, see 18), LVDS_RXC_P (out, see 18), LVDS_RXD_N (out, see 18), LVDS_RXD_P (out, see 18), LVDS_TXC_N (in, see 18), LVDS_TXC_P (in, see 18), LVDS_TXD_N (in, see 18), LVDS_TXD_P (in, see 18), RS_422_RX+ (bidir, see 21), RS_422_RX- (bidir, see 21), RS_422_TX+ (in, see 21), RS_422_TX- (in, see 21), SAM_AX100U_I2C_SCL (bidir, see 8), SAM_AX100U_I2C_SDA (bidir, see 8), SAM_HOST_UART_RXD (bidir, see 8), SAM_HOST_UART_TXD (bidir, see 8), SAM_OEM719_PPS (bidir, see 5, 8), SAM_OEM719_UART_RX (bidir, see 5, 8), SAM_OEM719_UART_TX (bidir, see 5, 8), SPI_CLK_EXP (bidir, see 4, 5), SPI_CS_EXP (bidir, see 4, 5), SPI_MISO_EXP (bidir, see 4, 5), SPI_MOSI_EXP (bidir, see 4, 5), STX_GPIO_EN (bidir, see 8), SW_2_CONN_USB_N (bidir, see 13), SW_2_CONN_USB_P (bidir, see 13), TURN_ON_IF (out, see 3, 4)

### Nets
3V3_COM: J12.03 J12.04 J12.17 J12.18 J14#1.2 R45.2 R47.2
BUS_3V3: H2.27 H2.28
BUS_5V: H2.25 H2.26
GND: H2.29 H2.30 H2.31 H2.32 H2.47 H2.48 J3.1 J3.7 J4.3 J4.7 J5.5 J5.M1 J5.M2 J6.4 J6.M1 J6.M2 J8.1 J8.7 J12.01 J12.02 J12.19 J12.20 J14#1.10 J14#1.13 J14#1.16 J14#1.18 R233.1
GOM_VBAT: H2.45 H2.46
STX_12V: H2.23 H2.24
VBUS/EN: D12.2(A) J6.1 R232.1
CAN_A7_H: H1.03 R235.2 ; port CAN_H_main
CAN_A7_L: H1.01 R234.2 ; port CAN_L_main
CAN_AX_H: J12.07 R235.1 ; port CAN_H_AX100U
CAN_AX_L: J12.08 R234.1 ; port CAN_L_AX100U
CLK_EXP_CONNECTOR: J3.4 R240.2
CLK_EXP_PC104: H1.23 R221.2
CS_EXP_CONNECTOR: J3.3 R239.2
CS_EXP_PC104: H1.21 R220.2
EXP_2_CONN_USB_N: R236.1 ; port EXP_2_CONN_USB_N
EXP_2_CONN_USB_P: R237.1 ; port EXP_2_CONN_USB_P
FLEXCOM1_I2C_SCL: R231.2 R241.1 ; port I2C_SCL_EXP
FLEXCOM1_I2C_SDA: R229.2 R238.1 ; port I2C_SDA_EXP
FLEXCOM4_I2C_SCL: J12.05 R45.1 ; port SAM_AX100U_I2C_SCL
FLEXCOM4_I2C_SDA: J12.06 R47.1 ; port SAM_AX100U_I2C_SDA
FLEXCOM5_I2C_SCL: R230.1 ; port I2C2_SCL_SAM_PC104
FLEXCOM5_I2C_SDA: R228.1 ; port I2C2_SDA_SAM_PC104
FLEXCOM6_UART_RX: J14#1.14 R226.1 ; port SAM_OEM719_UART_RX
FLEXCOM6_UART_TX: J14#1.15 R94.1 ; port SAM_OEM719_UART_TX
FLEXCOM7_UART_RX: J14#1.11 ; port SAM_HOST_UART_RXD
FLEXCOM7_UART_TX: J14#1.12 ; port SAM_HOST_UART_TXD
IF_USB_CONN_N: J6.2 R114.2 R236.2
IF_USB_CONN_P: J6.3 R115.2 R237.2
LVDS_RXC_N: J5.9 ; port LVDS_RXC_N
LVDS_RXC_P: J5.8 ; port LVDS_RXC_P
LVDS_RXD_N: J5.4 ; port LVDS_RXD_N
LVDS_RXD_P: J5.3 ; port LVDS_RXD_P
LVDS_TXC_N: J5.7 ; port LVDS_TXC_N
LVDS_TXC_P: J5.6 ; port LVDS_TXC_P
LVDS_TXD_N: J5.2 ; port LVDS_TXD_N
LVDS_TXD_P: J5.1 ; port LVDS_TXD_P
MISO_EXP_CONNECTOR: J3.6 R243.2
MISO_EXP_PC104: H1.27 R223.2
MOSI_EXP_CONNECTOR: J3.5 R242.2
MOSI_EXP_PC104: H1.25 R222.2
RS_422_2_PC104_RX_N: R177.1 R218.1 R224.1
RS_422_2_PC104_RX_P: R182.1 R219.1 R225.2
RS_422_2_PC104_TX_N: R176.1 R217.1
RS_422_2_PC104_TX_P: R120.1 R216.1
RS_422_RX_N: R77.1 R177.2 ; port RS_422_RX-
RS_422_RX_P: R109.1 R182.2 ; port RS_422_RX+
RS_422_TX_N: R75.1 R176.2 ; port RS_422_TX-
RS_422_TX_P: R53.1 R120.2 ; port RS_422_TX+
SCL_EXP_CONNECTOR: J4.5 J4.6 R241.2
SDA_EXP_CONNECTOR: J4.1 J4.2 R238.2
SPI_CLK_EXP: R221.1 R240.1 ; port SPI_CLK_EXP
SPI_CS_EXP: R220.1 R239.1 ; port SPI_CS_EXP
SPI_MISO_EXP: R223.1 R243.1 ; port SPI_MISO_EXP
SPI_MOSI_EXP: R222.1 R242.1 ; port SPI_MOSI_EXP
STX_GPIO: R215.2 ; port STX_GPIO_EN
SW_2_CONN_USB_N: R114.1 ; port SW_2_CONN_USB_N
SW_2_CONN_USB_P: R115.1 ; port SW_2_CONN_USB_P
NetD6#1_1: D13.1 ; port TURN_ON_IF
NetD12_1: D12.1(K) R233.2
NetD13_2: D13.2 R232.2
NetH1_06: H1.06 R215.1
NetH1_09: H1.09 R216.2
NetH1_11: H1.11 R217.2
NetH1_13: H1.13 R218.2
NetH1_14: H1.14 R227.1
NetH1_15: H1.15 R219.2
NetH1_37: H1.37 R224.2
NetH1_38: H1.38 R225.1
NetH1_39: H1.39 R226.2
NetH1_41: H1.41 R94.2
NetH1_43: H1.43 R228.2
NetH1_44: H1.44 R229.1
NetH1_45: H1.45 R230.2
NetH1_46: H1.46 R231.1
NetJ8_3: J8.3 R53.2
NetJ8_4: J8.4 R75.2
NetJ8_5: J8.5 R77.2
NetJ8_6: J8.6 R109.2
NetJ14#1_19: J14#1.19 R227.2 ; port SAM_OEM719_PPS

Not connected (* = marked no-connect by the designer): H1 02* 04* 05* 07* 08* 10* 12* 16* 17* 18* 19* 20* 22* 24* 26* 28* 29* 30* 31* 32* 33* 34* 35* 36* 40* 42* 47* 48* 49* 50* 51* 52*; H2 01* 02* 03* 04* 05* 06* 07* 08* 09* 10* 11* 12* 13* 14* 15* 16* 17* 18* 19* 20* 21* 22* 33* 34* 35* 36* 37* 38* 39* 40* 41* 42* 43* 44* 49* 50* 51* 52*; J3 2*; J4 4*; J8 2*; J12 09* 10* 11* 12* 13* 14* 15* 16*; J14#1 1* 3* 4* 5* 6* 7* 8* 9* 17* 20*

### Layout directives
differential pair; differential pair class DIFF90; net class DIFF90; rule Matched Net Lengths [Tolerance = 4mil]: IF_USB_CONN_N, IF_USB_CONN_P, LVDS_RXC_N, LVDS_RXC_P, LVDS_RXD_N, LVDS_RXD_P, LVDS_TXC_N, LVDS_TXC_P, LVDS_TXD_N, LVDS_TXD_P, RS_422_2_PC104_RX_N, RS_422_2_PC104_RX_P, RS_422_2_PC104_TX_N, RS_422_2_PC104_TX_P, RS_422_RX_N, RS_422_RX_P, RS_422_TX_N, RS_422_TX_P

### Notes on the sheet
- RS422_Z
- RS422_Y
- RS422/RS485_A
- RS422/RS485_B
- USB 4 pin P,D, VBUS (enable efuse), đất
- Project:
- Page Contents:
- Revision:
- Design:
- Date:
- Size:
- A3
- Document Number:
- Sheet:
- of
- (in symbol 5040500691) TAB

### Library data of the parts
D12 = LED_BLUE
D13 = 1N4148W-TP: Description; Manufacturer_Name: MCC; Copyright: Copyright (C) 2026 Ultra Librarian. All rights reserved.; Manufacturer_Part_Number: 1N4148W-TP
H1 H2 = ESQ-126-14-G-D: CONN SOCKET 52POS 0.1 GOLD PCB; MF: Samtec; MP: ESQ-126-14-G-D; Price: None; Package: None; Value: *; Availability: Unavailable
J3 J4 J8 = 5040500691: 1.50mm Pitch, Pico-Lock PCB Header, Single Row, Right-Angle, Surface Mount, Gold (Au) Plating, Positive Lock, 6 Circuits, Tape and Reel; Manufacturer_Name: Molex Connector Corporation; Copyright: Copyright (C) 2025 Ultra Librarian. All rights reserved.; Manufacturer_Part_Number: 5040500691; Datasheet: https://www.molex.com/en-us/products/part-detail-pdf/5040500691?display=pdf; RefDes: RefDes; Type: Type
J5 = 5040500991: as J2-2 on sheet CONNECTOR_EXP
J6 = Header 4x1_2M
J12 = FSI-110-03-X-D-AD-TR: CONN STACKING 20POS SMD GOLD; Price: None; Value: *; Package: None; MP: FSI-110-03-X-D-AD-TR; Availability: Unavailable
J14#1 = SAMTEC-TLE-110-01-X-DV-A: CONN RCPT 20POS 0.079 GOLD SMD; Availability: Unavailable; MP: SAMTEC-TLE-110-01-X-DV-A; Price: None; Value: *; Package: None
R45 R47 R53 R75 R77 R94 R109 R114 R115 R120 R176 R177 R182 R215-R243 = _RES_B_2: RES

## Sheet SAMA7D65_PMIC.SchDoc
size 420 x 297 mm; SheetNumber: 6; SheetTotal: 23
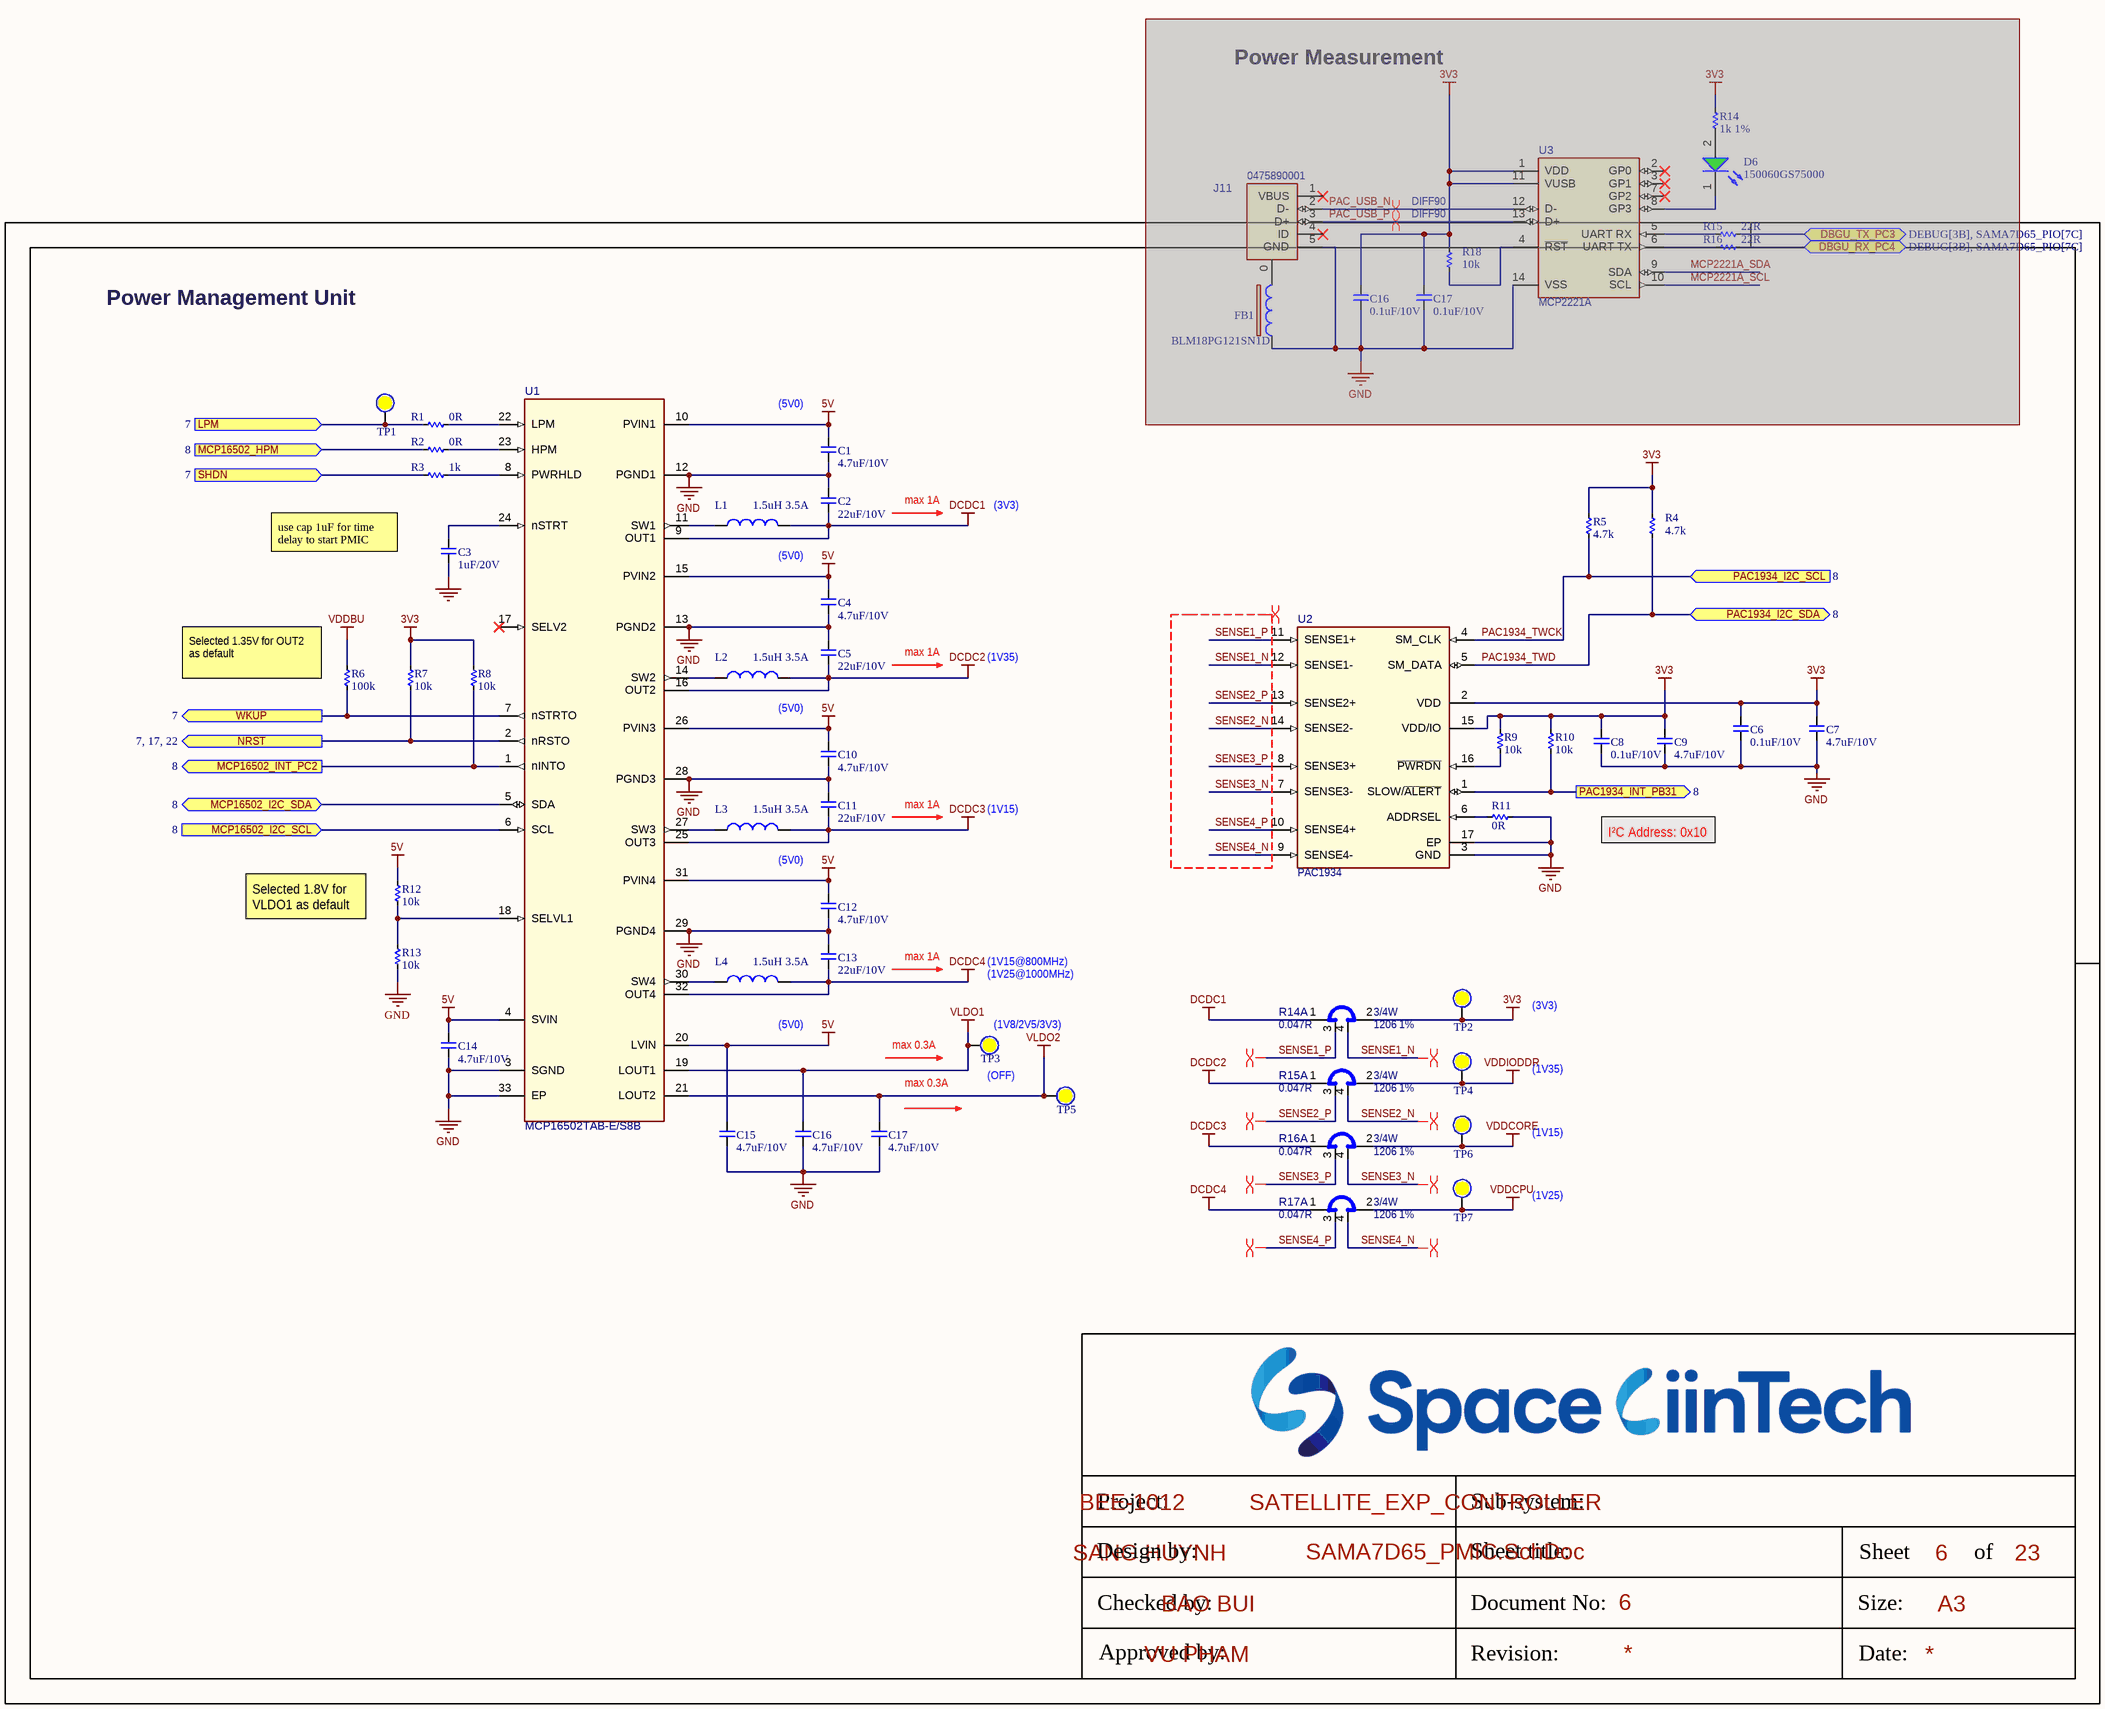
[diagram p6: SAMA7D65_PMIC.SchDoc]

### Parts
(Parts that share a designator on the sheet are numbered #1, #2 ... from top to bottom, then left to right.)
C1  4.7uF/10V  [CAP_C_1005X50_L]
C2  22uF/10V  [CAP_C_1608X80]
C3  1uF/20V  [CAP_C_1005X50_L]
C4  4.7uF/10V  [CAP_C_1005X50_L]
C5  22uF/10V  [CAP_C_1608X80]
C6  0.1uF/10V  [CAP_C_1005X50_L]
C7  4.7uF/10V  [CAP_C_1005X50_L]
C8  0.1uF/10V  [CAP_C_0603x30]
C9  4.7uF/10V  [CAP_C_1005X50_L - duplicate]
C10  4.7uF/10V  [CAP_C_1005X50_L]
C11  22uF/10V  [CAP_C_1608X80]
C12  4.7uF/10V  [CAP_C_1005X50_L]
C13  22uF/10V  [CAP_C_1608X80]
C14  4.7uF/10V  [CAP_C_1005X50_L - duplicate]
C15  4.7uF/10V  [CAP_C_1005X50_L]
C16#1  0.1uF/10V  [CAP_C_1005X60]  (masked out: inside a compile mask, not in the netlist)
C16#2  4.7uF/10V  [CAP_C_1005X50_L]
C17#1  0.1uF/10V  [CAP_C_1005X60]  (masked out: inside a compile mask, not in the netlist)
C17#2  4.7uF/10V  [CAP_C_1005X50_L]
D6#2  150060GS75000  [LED-0603-GREEN]  (masked out: inside a compile mask, not in the netlist)
FB1#1  BLM18PG121SN1D  [IND_BLM18_0603_MUR]  (masked out: inside a compile mask, not in the netlist)
J11#2  value 0475890001  [CON_USB_Micro-AB_SMD_RA_MOLEX_0475890001]  (hidden comment: CON USB2.0 Mini_Micro)  (masked out: inside a compile mask, not in the netlist)
L1  1.5uH 3.5A  [IND_C_1008]
L2  1.5uH 3.5A  [IND_C_1008]
L3  1.5uH 3.5A  [IND_C_1008]
L4  1.5uH 3.5A  [IND_C_1008]
R1  0R  [RES_C_0603X30]
R2  0R  [RES_C_0603X30]
R3  1k  [RES_C_0603X30]
R4  4.7k  [RES_C_1005x30_L]
R5  4.7k  [RES_C_1005x30_L]
R6  100k  [RES_C_0603X30]
R7  10k  [RES_C_0603X30]
R8  10k  [RES_C_0603X30]
R9  10k  [RES_C_1005x30_L]
R10  10k  [RES_C_1005x30_L]
R11  0R  [RES_C_0603X30]
R12  10k  [RES_C_1005x30_L]
R13  10k  [RES_C_1005x30_L]
R14#1  1k 1%  [RES_C_1005x30_L]  (masked out: inside a compile mask, not in the netlist)
R14#2  value 0.047R  Package: 1206  Tolerance: 1%  Power: 3/4W  [RES_C_1206_SHUNT]  (hidden comment: Shunt 4 Pin)  (part A of 2)
R15#1  22R  [RES_C_1005x30_L]  (masked out: inside a compile mask, not in the netlist)
R15#2  value 0.047R  Package: 1206  Tolerance: 1%  Power: 3/4W  [RES_C_1206_SHUNT]  (hidden comment: Shunt 4 Pin)  (part A of 2)
R16#1  22R  [RES_C_1005x30_L]  (masked out: inside a compile mask, not in the netlist)
R16#2  value 0.047R  Package: 1206  Tolerance: 1%  Power: 3/4W  [RES_C_1206_SHUNT]  (hidden comment: Shunt 4 Pin)  (part A of 2)
R17  value 0.047R  Package: 1206  Tolerance: 1%  Power: 3/4W  [RES_C_1206_SHUNT]  (hidden comment: Shunt 4 Pin)  (part A of 2)
R18#1  10k  [RES_C_1005x30_L]  (masked out: inside a compile mask, not in the netlist)
TP1  (no value)  [Test point]  (no BOM)
TP2  (no value)  [Test point]  (no BOM)
TP3  (no value)  [Test point]  (no BOM)
TP4  (no value)  [Test point]  (no BOM)
TP5  (no value)  [Test point]  (no BOM)
TP6  (no value)  [Test point]  (no BOM)
TP7  (no value)  [Test point]  (no BOM)
U1  value MCP16502TAB-E/S8B  [QFN-32_5X5_EP3.7X3.7]  (hidden comment: MCP16502 QFN-32)
U2  value PAC1934  [UQFN-16_4X4_EP2.6X2.6]  (hidden comment: Microchip PAC1934 UQFN-16)
U3#1  value MCP2221A  [SOIC-14]  (hidden comment: MCP2221 SOIC-14_TSSOP-14_PDIP-14)  (masked out: inside a compile mask, not in the netlist)

### Ports
DBGU_RX_PC4 (bidir, see DEBUG[3B], SAMA7D65_PIO[7C]), DBGU_TX_PC3 (bidir, see DEBUG[3B], SAMA7D65_PIO[7C]), LPM (in, see 7), MCP16502_HPM (in, see 8), MCP16502_I2C_SCL (in, see 8), MCP16502_I2C_SDA (bidir, see 8), MCP16502_INT_PC2 (out, see 8), NRST (out, see 7, 17, 22), PAC1934_I2C_SCL (in, see 8), PAC1934_I2C_SDA (bidir, see 8), PAC1934_INT_PB31 (out, see 8), SHDN (in, see 7), WKUP (out, see 7)

### Nets
3V3: C6.2 C7.2 C8.2 C9.2 R4.1 R5.1 R7.2 R8.2 R9.2 R10.2 R14#2.2 TP2.0 U2.2(VDD) U2.15(VDD/IO)
5V: C1.2 C4.2 C10.2 C12.2 C14.2 C15.2 R12.2 U1.4(SVIN) U1.10(PVIN1) U1.15(PVIN2) U1.20(LVIN) U1.26(PVIN3) U1.31(PVIN4)
DCDC1: C2.1 L1.2 R14#2.1 U1.9(OUT1)
DCDC2: C5.1 L2.2 R15#2.1 U1.16(OUT2)
DCDC3: C11.1 L3.2 R16#2.1 U1.25(OUT3)
DCDC4: C13.1 L4.2 R17.1 U1.32(OUT4)
GND: C1.1 C2.2 C3.1 C4.1 C5.2 C6.1 C7.1 C8.1 C9.1 C10.1 C11.2 C12.1 C13.2 C14.1 C15.1 C16#2.1 C17#2.1 R11.2 R13.1 U1.3(SGND) U1.12(PGND1) U1.13(PGND2) U1.28(PGND3) U1.29(PGND4) U1.33(EP) U2.3(GND) U2.17(EP)
VDDBU: R6.2
VDDCORE: R16#2.2 TP6.0
VDDCPU: R17.2 TP7.0
VDDIODDR: R15#2.2 TP4.0
VLDO1: C16#2.2 TP3.0 U1.19(LOUT1)
VLDO2: C17#2.2 TP5.0 U1.21(LOUT2)
HPM_MCP16502: R2.1 ; port MCP16502_HPM
LPM: R1.1 TP1.0 ; port LPM
NRST: R7.1 U1.2(nRSTO) ; port NRST
PAC1934_TWCK: R5.2 U1.6(SCL) U2.4(SM_CLK) ; port MCP16502_I2C_SCL, port PAC1934_I2C_SCL  [project net FLEXCOM10_I2C_SCL]
PAC1934_TWD: R4.2 U1.5(SDA) U2.5(SM_DATA) ; port MCP16502_I2C_SDA, port PAC1934_I2C_SDA  [project net FLEXCOM10_I2C_SDA]
SENSE1_N: R14#2.4 U2.12(SENSE1-)
SENSE1_P: R14#2.3 U2.11(SENSE1+)
SENSE2_N: R15#2.4 U2.14(SENSE2-)
SENSE2_P: R15#2.3 U2.13(SENSE2+)
SENSE3_N: R16#2.4 U2.7(SENSE3-)
SENSE3_P: R16#2.3 U2.8(SENSE3+)
SENSE4_N: R17.4 U2.9(SENSE4-)
SENSE4_P: R17.3 U2.10(SENSE4+)
SHDN: R3.1 ; port SHDN
WKUP: R6.1 U1.7(nSTRTO) ; port WKUP
NetC3_2: C3.2 U1.24(nSTRT)
NetL1_1: L1.1 U1.11(SW1)
NetL2_1: L2.1 U1.14(SW2)
NetL3_1: L3.1 U1.27(SW3)
NetL4_1: L4.1 U1.30(SW4)
NetR1_2: R1.2 U1.22(LPM)
NetR2_2: R2.2 U1.23(HPM)
NetR3_2: R3.2 U1.8(PWRHLD)
NetR8_1: R8.1 U1.1(nINTO) ; port MCP16502_INT_PC2
NetR9_1: R9.1 U2.16(~{PWRDN})
NetR10_1: R10.1 U2.1(SLOW/~{ALERT}) ; port PAC1934_INT_PB31
NetR11_1: R11.1 U2.6(ADDRSEL)
NetR12_1: R12.1 R13.2 U1.18(SELVL1)

Not connected (* = marked no-connect by the designer): U1 17(SELV2)*

### Layout directives
differential pair: SENSE1_N, SENSE1_P, SENSE2_N, SENSE2_P, SENSE3_N, SENSE3_P, SENSE4_N, SENSE4_P
differential pair; differential pair class DIFF90; net class DIFF90; rule Matched Net Lengths [Tolerance = 4mil]: (no net found under the mark), SENSE1_N, SENSE1_P, SENSE2_N, SENSE2_P, SENSE3_N, SENSE3_P, SENSE4_N, SENSE4_P

### Notes on the sheet
- Power Measurement
- Power Management Unit
- (near C1) (5V0)
- max 1A
- (3V3)
- use cap 1uF for time delay to start PMIC
- (near L1) (5V0)
- (near R6) Selected 1.35V for OUT2 as default
- (near L2) (5V0)
- (1V35)
- (1V15)
- I²C Address: 0x10
- (near L3) (5V0)
- Selected 1.8V for VLDO1 as default
- (1V15@800MHz)
- (near L4) (5V0)
- (1V25@1000MHz)
- (near TP3) (1V8/2V5/3V3)
- (near TP3) max 0.3A
- max 0.3A
- (near TP3) (OFF)
- (1V25)
- Project:
- BEE-1012
- Sub-system:
- SATELLITE_EXP_CONTROLLER
- Design by:
- SANG HUYNH
- BAO BUI
- Sheet title:
- Sheet
- A3
- of
- Checked by:
- Approved by:
- VU PHAM
- Revision:
- Document No:
- Size:
- Date:

### Library data of the parts
C1-C15 C16#1 C16#2 C17#1 C17#2 = _CAP_C_2: CAP CHIP
D6#2 = LED_GREEN: LED GREEN CLEAR 0603 SMD
FB1#1 = BLM18PG121SN1D: FERRITE BEAD 120 OHM 0603 1LN; Manufacturer_Name: Murata; Copyright: Copyright (C) 2025 Ultra Librarian. All rights reserved.; Manufacturer_Part_Number: BLM18PG121SN1D
J11#2 = 0475890001: CONN RCPT MICRO USB AB 5P SMD RA; Manufacturer 1: Molex, LLC; MCHP-ID: CON1753; Description_: CON USB2.0 MICRO-AB FEMALE SMD R/A; Dev Tools Status: Production; Owner: Dragos Danaila; Voltage: 30VAC; Current: 1A, 1.8A; Custom Parameters: 10000 mating cycles; Populated: YES; Revision: 1; Symbol: CON USB2.0 Mini_Micro; Status: MCL Design; ComponentLink1URL: https://chn-vm-apps.microchip.com/mchprepo/parts/Datasheets/475890001_sd.pdf; ComponentLink1Description: SVN Datasheet; ComponentLink2URL: C:\ALTIUM_WORK\00001_MCHP-CDB\Datasheets\475890001_sd.pdf; ComponentLink2Description: Local Datasheet; ComponentLink3URL: C:\ALTIUM_WORK\00001_MCHP-CDB\Library\LibraryRefs\CON USB2.0 Mini_Micro.SchLib; ComponentLink3Description: Open Symbol; ComponentLink4URL: C:\ALTIUM_WORK\00001_MCHP-CDB\Library\Footprints\CON_USB_Micro-AB_SMD_RA_MOLEX_0475890001.PcbLib; ComponentLink4Description: Open Footprint; ComponentLink5Description: Open Footprint 2; ComponentLink6Description: Open Footprint 3; ComponentLink7Description: Open Footprint 4; Type: USB; Category: Connector; Manufacturer Part Number 1: 0475890001; Supplier 1: Digi-Key; Supplier Part Number 1: WM17143CT-ND; Quantity Override: 1; Operating Temperature: -35C to +85C; Assembly Type: SMD
L1-L4 = DFE252012P-1R5M=P2: Fixed Inductor 1.5uH 3.5A R060 SMD; Package: None; Price: None; Value: *; MP: DFE252012P-1R5M=P2; Availability: Unavailable
R1-R13 R14#1 R15#1 R16#1 R18#1 = _RES_B_2: RES
R14#2 R15#2 R16#2 R17 = SHUNT: Shunt Resistor, RES 0.047 OHM 1% 3/4W 1206; Manufacturer 1: SUSUMU; Manufacturer Part Number 1: KRL1632E-M-R047-F-T5; MCHP-ID: RSMT1405; Description_: RES SHUNT MF 0.047R 1% 3/4W SMD 1206; Dev Tools Status: Design; Current: 4A; Owner: Ciprian Abramov; Populated: YES; Temperature Coefficient: ±50ppm/C; Restricted Sourcing: No; Revision: 1; Symbol: Shunt 4 Pin; Status: MCL Design; ComponentLink1URL: https://chn-vm-apps.microchip.com/mchprepo/parts/Datasheets/n_catalog_partition09_en.pdf; ComponentLink1Description: SVN Datasheet; ComponentLink2URL: C:\ALTIUM_WORK\00001_MCHP-CDB\Datasheets\n_catalog_partition09_en.pdf; ComponentLink2Description: Local Datasheet; ComponentLink3URL: C:\ALTIUM_WORK\00001_MCHP-CDB\Library\LibraryRefs\Shunt 4 Pin.SchLib; ComponentLink3Description: Open Symbol; ComponentLink4URL: C:\ALTIUM_WORK\00001_MCHP-CDB\Library\Footprints\RES_C_1206_SHUNT.PcbLib; ComponentLink4Description: Open Footprint; ComponentLink5Description: Open Footprint 2; ComponentLink6Description: Open Footprint 3; ComponentLink7Description: Open Footprint 4; Operating Temperature: -55C to 155C; Category: Resistor; Type: Shunt; Composition: MF; Supplier 1: Digi-Key; Supplier Part Number 1: 408-1578-2-ND; Quantity Override: 1
TP1-TP7 = Test Point: Solder: NF
U1 = MIC8878: Manufacturer 1: Microchip Technology; Populated: YES; Description_: MCHP ANALOG PMIC SWITCHER Buck ADJ MCP16502TAB-E/S8B QFN-32 for SAMA7G5 MPU with LPDDR/DDR2/DDR3; Dev Tools Status: Design; Owner: Dragos Danaila; MCHP-ID: MIC8878; Symbol: MCP16502 QFN-32; Type: Switcher; Status: MCL Design; Revision: 1; Category: MCHP-Analog; ComponentLink1Description: SVN Datasheet; ComponentLink2Description: Local Datasheet; ComponentLink3URL: C:\ALTIUM_WORK\00001_MCHP-CDB\Library\LibraryRefs\MCP16502 QFN-32.SchLib; ComponentLink3Description: Open Symbol; ComponentLink4URL: C:\ALTIUM_WORK\00001_MCHP-CDB\Library\Footprints\QFN-32_5X5_EP3.7X3.7.PcbLib; ComponentLink4Description: Open Footprint; ComponentLink5Description: Open Footprint 2; ComponentLink6Description: Open Footprint 3; ComponentLink7Description: Open Footprint 4; Manufacturer Part Number 1: MCP16502TAB-E/S8B; Supplier 1: Digi-Key; Supplier Part Number 1: 150-MCP16502TAB-E/S8BCT-ND; Quantity Override: 1; ComponentLink2URL: C:\ALTIUM_WORK\00001_MCHP-CDB\Datasheets\MCP16502-High-Performance-PMIC-for-SAMA5DX-SAM9X6-MPUs-Data-Sheet-DS20006275B.pdf
U2 = PAC1934T-I/JQ: IC CURRENT MONITOR 1% 16UQFN; Manufacturer 1: Microchip Technology; MCHP-ID: MIC7010; Description_: MCHP ANALOG POWER CURRENT SENSE MONITOR PAC1934T-I/JQ UQFN-16; Dev Tools Status: Production; Owner: Razvan Cristescu; Populated: YES; Restricted Sourcing: No; Symbol: PAC1934 UQFN-16; Type: Power/Current Sensor; Status: MCL Design; Revision: 2; Category: MCHP-Analog; ComponentLink1Description: SVN Datasheet; ComponentLink2Description: Local Datasheet; ComponentLink3URL: C:\ALTIUM_WORK\00001_MCHP-CDB\Library\LibraryRefs\PAC1934 UQFN-16.SchLib; ComponentLink3Description: Open Symbol; ComponentLink4URL: C:\ALTIUM_WORK\00001_MCHP-CDB\Library\Footprints\UQFN-16_4X4_EP2.6X2.6.PcbLib; ComponentLink4Description: Open Footprint; ComponentLink5Description: Open Footprint 2; ComponentLink6Description: Open Footprint 3; ComponentLink7Description: Open Footprint 4; Manufacturer Part Number 1: PAC1934T-I/JQ; Supplier 1: Microchip Technology; Supplier Part Number 1: PAC1934T-I/JQ; Quantity Override: 1; ComponentLink1URL: https://www.microchip.com/sitesearch/search/Product%20and%20Development%20Tools/PAC1934T-I/JQ; Operating Temperature: -40C to +85C
U3#1 = MCP2221A-I/SL: IC USB TO I2C/UART 14SOIC; Manufacturer 1: Microchip Technology; MCHP-ID: MIC9078; Description_: MCHP INTERFACE USB I2C UART MCP2221A-I/SL SOIC-14; Dev Tools Status: Design; Owner: Octavian Stroe; Populated: YES; Symbol: MCP2221 SOIC-14_TSSOP-14_PDIP-14; Type: USB; Status: MCL Design; Revision: A; Category: MCHP-Interface; ComponentLink1URL: https://chn-vm-apps.microchip.com/mchprepo/parts/Datasheets/20005292B.pdf; ComponentLink1Description: SVN Datasheet; ComponentLink2URL: C:\ALTIUM_WORK\00001_MCHP-CDB\Datasheets\20005292B.pdf; ComponentLink2Description: Local Datasheet; ComponentLink3URL: C:\ALTIUM_WORK\00001_MCHP-CDB\Library\LibraryRefs\MCP2221 SOIC-14_TSSOP-14_PDIP-14.SchLib; ComponentLink3Description: Open Symbol; ComponentLink4URL: C:\ALTIUM_WORK\00001_MCHP-CDB\Library\Footprints\SOIC-14.PcbLib; ComponentLink4Description: Open Footprint; ComponentLink5Description: Open Footprint 2; ComponentLink6Description: Open Footprint 3; ComponentLink7Description: Open Footprint 4; Manufacturer Part Number 1: MCP2221A-I/SL; Manufacturer 2: Microchip Technology; Manufacturer Part Number 2: MCP2221A-I/SL; Supplier 1: Digi-Key; Supplier Part Number 1: MCP2221A-I/SL-ND; Supplier 2: Mouser; Supplier Part Number 2: 579-MCP2221A-I/SL; Operating Temperature: -40C to +85C; Quantity Override: 1

## Sheet SAMA7D65_MPU.SchDoc
size 420 x 297 mm; SheetNumber: 7; SheetTotal: 23
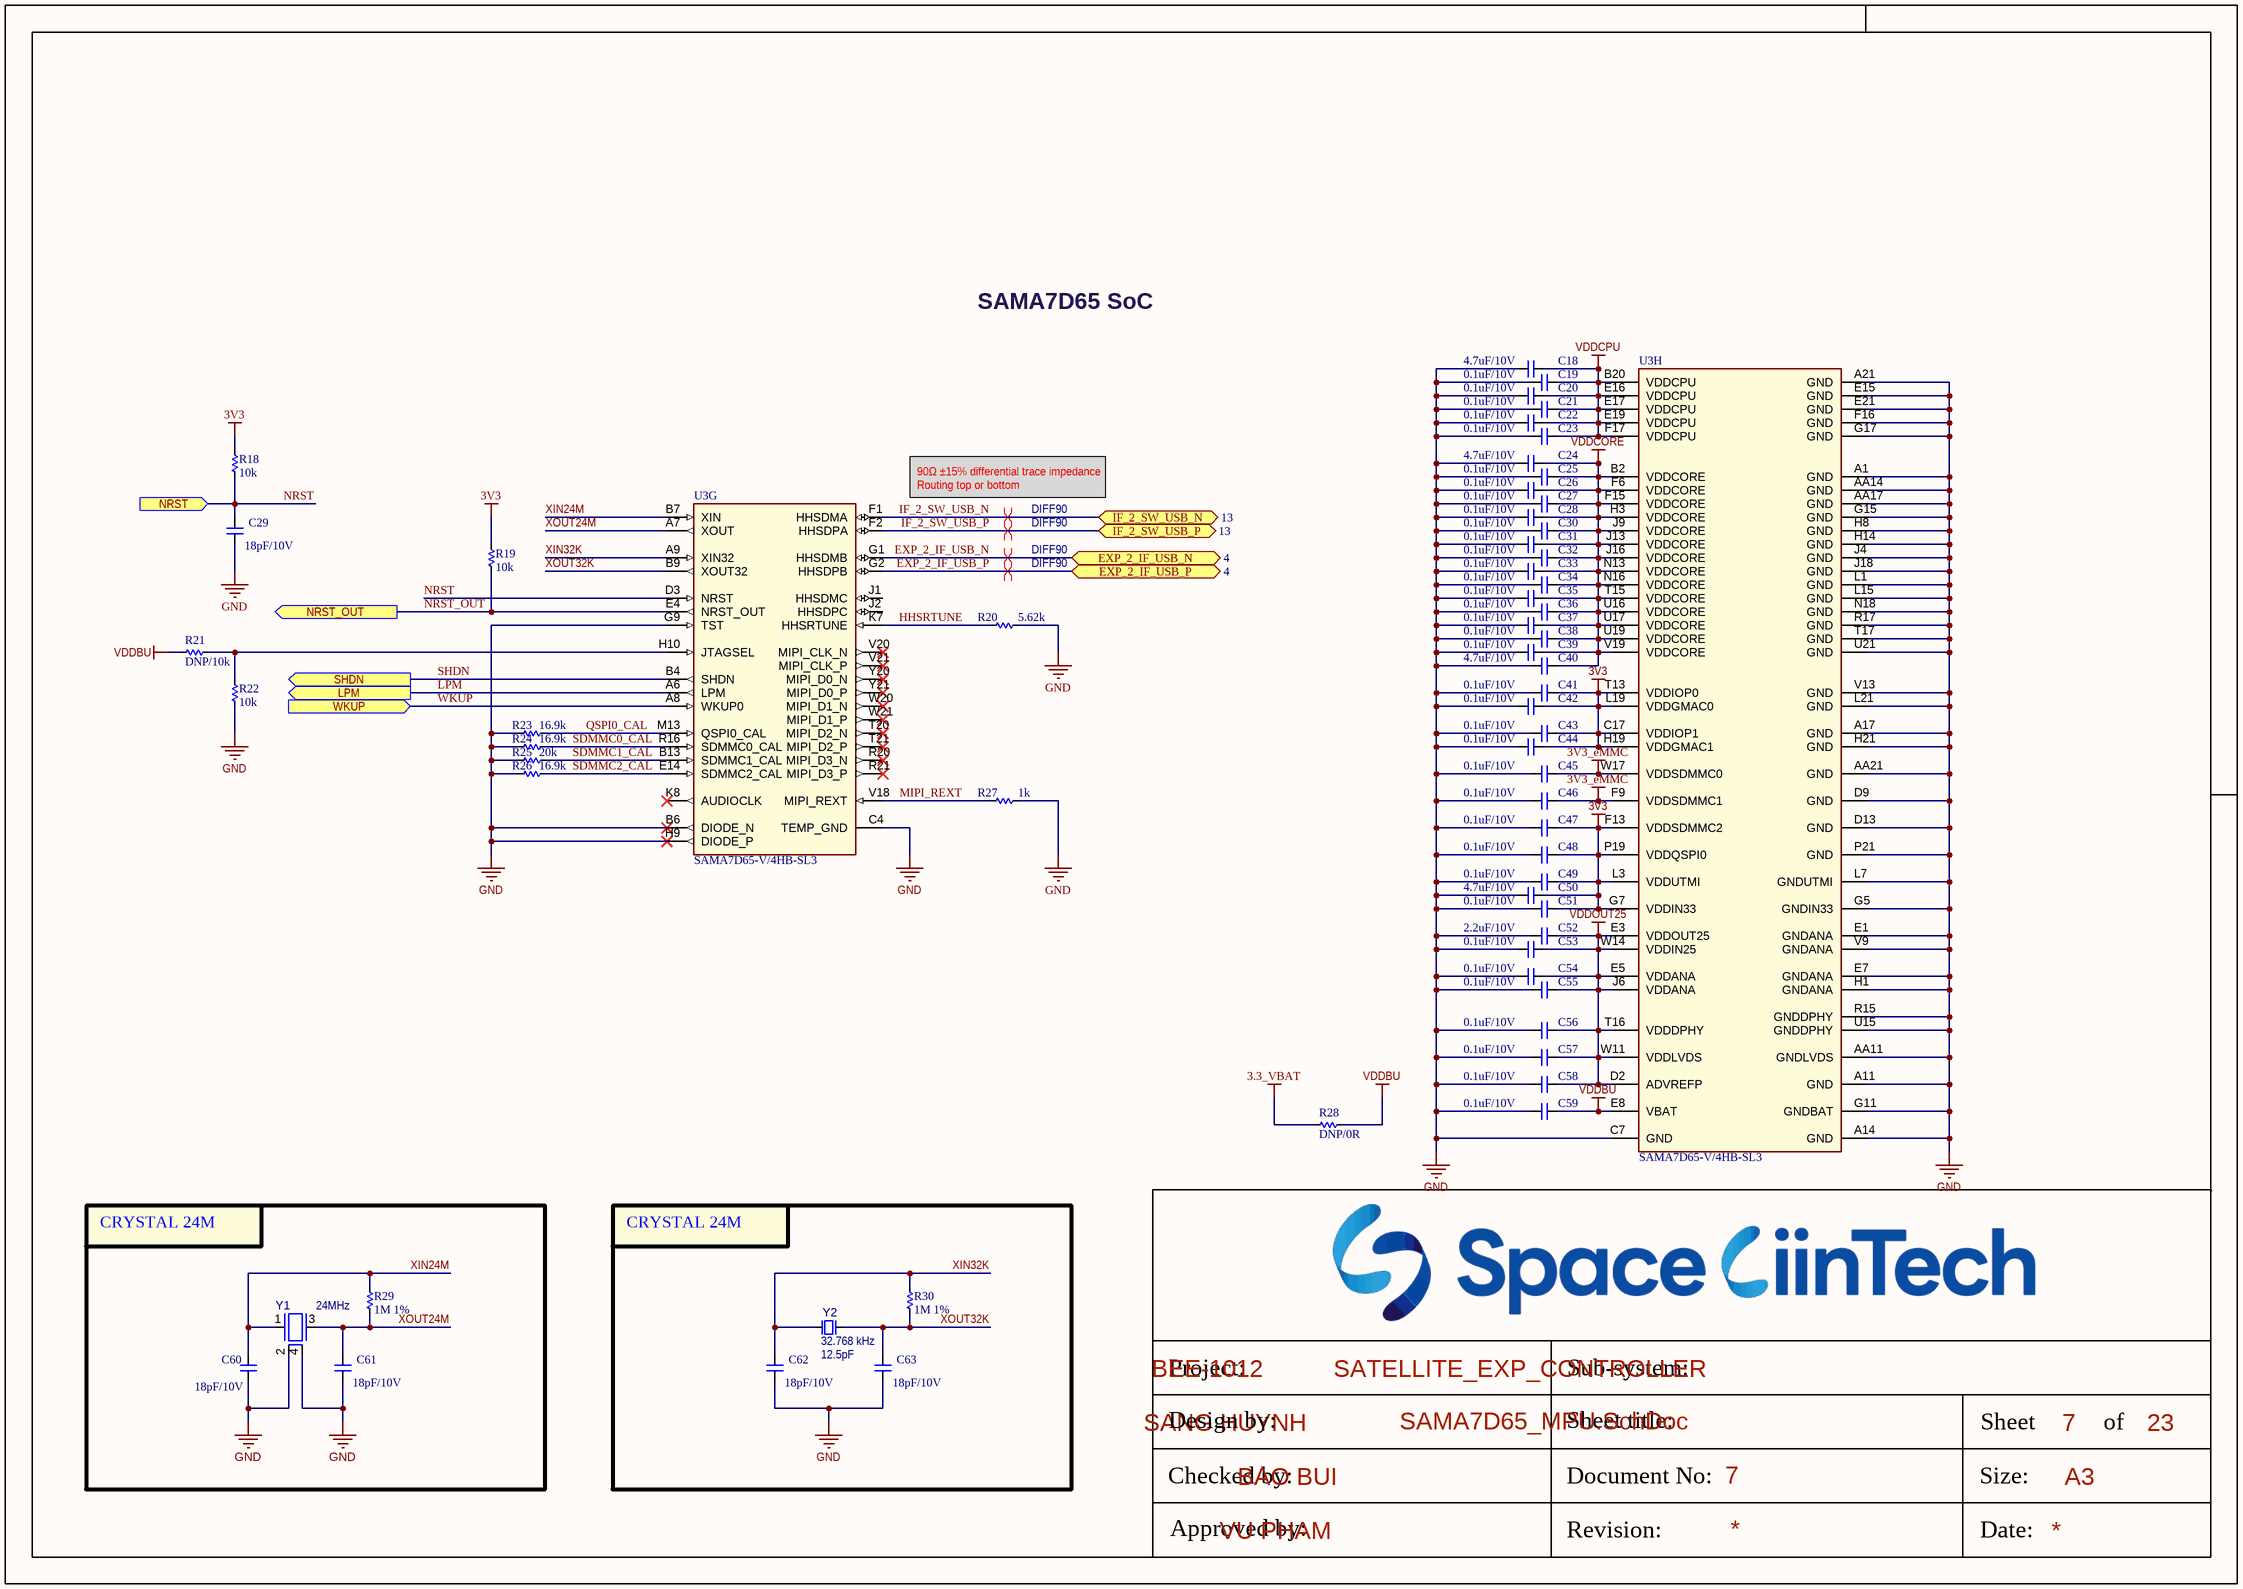
[diagram p7: SAMA7D65_MPU.SchDoc]

### Parts
(Parts that share a designator on the sheet are numbered #1, #2 ... from top to bottom, then left to right.)
C18  4.7uF/10V  [CAP_C_1005X50_L]
C19  0.1uF/10V  [CAP_C_0603x30]
C20  0.1uF/10V  [CAP_C_0603x30]
C21  0.1uF/10V  [CAP_C_0603x30]
C22  0.1uF/10V  [CAP_C_0603x30]
C23  0.1uF/10V  [CAP_C_0603x30]
C24  4.7uF/10V  [CAP_C_1005X50_L]
C25  0.1uF/10V  [CAP_C_0603x30]
C26  0.1uF/10V  [CAP_C_0603x30]
C27  0.1uF/10V  [CAP_C_0603x30]
C28  0.1uF/10V  [CAP_C_0603x30]
C29  18pF/10V  [CAP_C_0603x30]
C30  0.1uF/10V  [CAP_C_0603x30]
C31  0.1uF/10V  [CAP_C_0603x30]
C32  0.1uF/10V  [CAP_C_0603x30]
C33  0.1uF/10V  [CAP_C_0603x30]
C34  0.1uF/10V  [CAP_C_0603x30]
C35  0.1uF/10V  [CAP_C_0603x30]
C36  0.1uF/10V  [CAP_C_0603x30]
C37  0.1uF/10V  [CAP_C_0603x30]
C38  0.1uF/10V  [CAP_C_0603x30]
C39  0.1uF/10V  [CAP_C_0603x30]
C40  4.7uF/10V  [CAP_C_1005X50_L]
C41  0.1uF/10V  [CAP_C_0603x30]
C42  0.1uF/10V  [CAP_C_0603x30]
C43  0.1uF/10V  [CAP_C_0603x30]
C44  0.1uF/10V  [CAP_C_0603x30]
C45  0.1uF/10V  [CAP_C_0603x30]
C46  0.1uF/10V  [CAP_C_0603x30]
C47  0.1uF/10V  [CAP_C_0603x30]
C48  0.1uF/10V  [CAP_C_0603x30]
C49  0.1uF/10V  [CAP_C_0603x30]
C50  4.7uF/10V  [CAP_C_1005X50_L]
C51  0.1uF/10V  [CAP_C_0603x30]
C52  2.2uF/10V  [CAP_C_1005X50_L]
C53  0.1uF/10V  [CAP_C_0603x30]
C54  0.1uF/10V  [CAP_C_0603x30]
C55  0.1uF/10V  [CAP_C_0603x30]
C56  0.1uF/10V  [CAP_C_0603x30]
C57  0.1uF/10V  [CAP_C_0603x30]
C58  0.1uF/10V  [CAP_C_0603x30]
C59  0.1uF/10V  [CAP_C_0603x30]
C60  18pF/10V  [CAP_C_0603x30]
C61  18pF/10V  [CAP_C_0603x30]
C62  18pF/10V  [CAP_C_0603x30]
C63  18pF/10V  [CAP_C_0603x30]
R18#2  10k  [RES_C_0603X30]
R19  10k  [RES_C_0603X30]
R20  5.62k  [RES_C_0603X30]
R21  DNP/10k  [RES_C_0603X30]
R22  10k  [RES_C_0603X30]
R23  16.9k  [RES_C_0603X30]
R24  16.9k  [RES_C_0603X30]
R25  20k  [RES_C_0603X30]
R26  16.9k  [RES_C_0603X30]
R27  1k  [RES_C_0603X30]
R28  DNP/0R  [RES_C_1005x30_L]
R29  1M 1%  [RES_C_1005x30_L]
R30  1M 1%  [RES_C_1005x30_L]
U3#2  value SAMA7D65-V/4HB-SL3  [TFBGA-343_14x14]  (hidden comment: SAMA7D65)  (parts G,H of 8)
Y1  value 24MHz  [XTAL_ECS2401037B2JTNTR]  (hidden comment: Crystal 4 Pins)
Y2  value 32.768 kHz  Load Capacitance: 12.5pF  [CRYSTAL_FC-12M_L2.05W1.2H0.6]  (hidden comment: Crystal 2 Pins)

### Blocks framed on the sheet
CRYSTAL 24M: C60 C61 R29 Y1
CRYSTAL 24M: C62 C63 R30 Y2

### Ports
EXP_2_IF_USB_N (bidir, see 4), EXP_2_IF_USB_P (bidir, see 4), IF_2_SW_USB_N (bidir, see 13), IF_2_SW_USB_P (bidir, see 13), LPM (out, see 6), NRST (in, see 6, 17, 22), NRST_OUT (out), SHDN (out, see 6), WKUP (in, see 6)

### Nets
3.3_VBAT: R28.1
3V3: C41.2 C42.2 C43.2 C44.2 C47.2 C48.2 C49.2 C50.2 C51.2 R18#2.1 R19.1 U3#2.C17(VDDIOP1) U3#2.F13(VDDSDMMC2) U3#2.G7(VDDIN33) U3#2.H19(VDDGMAC1) U3#2.L3(VDDUTMI) U3#2.L19(VDDGMAC0) U3#2.P19(VDDQSPI0) U3#2.T13(VDDIOP0)
3V3_eMMC: C45.2 C46.2 U3#2.F9(VDDSDMMC1) U3#2.W17(VDDSDMMC0)
GND: C18.1 C19.1 C20.1 C21.1 C22.1 C23.1 C24.1 C25.1 C26.1 C27.1 C28.1 C29.2 C30.1 C31.1 C32.1 C33.1 C34.1 C35.1 C36.1 C37.1 C38.1 C39.1 C40.1 C41.1 C42.1 C43.1 C44.1 C45.1 C46.1 C47.1 C48.1 C49.1 C50.1 C51.1 C52.1 C53.1 C54.1 C55.1 C56.1 C57.1 C58.1 C59.1 C60.2 C61.2 C62.2 C63.2 R20.2 R22.1 R23.1 R24.1 R25.1 R26.1 R27.2 U3#2.A1(GND) U3#2.A11(GND) U3#2.A14(GND) U3#2.A17(GND) U3#2.A21(GND) U3#2.AA11(GNDLVDS) U3#2.AA14(GND) U3#2.AA17(GND) U3#2.AA21(GND) U3#2.B6(DIODE_N) U3#2.C4(TEMP_GND) U3#2.C7(GND) U3#2.D9(GND) U3#2.D13(GND) U3#2.E1(GNDANA) U3#2.E7(GNDANA) U3#2.E15(GND) U3#2.E21(GND) U3#2.F16(GND) U3#2.G5(GNDIN33) U3#2.G9(TST) U3#2.G11(GNDBAT) U3#2.G15(GND) U3#2.G17(GND) U3#2.H1(GNDANA) U3#2.H8(GND) U3#2.H9(DIODE_P) U3#2.H14(GND) U3#2.H21(GND) U3#2.J4(GND) U3#2.J18(GND) U3#2.L1(GND) U3#2.L7(GNDUTMI) U3#2.L15(GND) U3#2.L21(GND) U3#2.N18(GND) U3#2.P21(GND) U3#2.R15(GNDDPHY) U3#2.R17(GND) U3#2.T17(GND) U3#2.U15(GNDDPHY) U3#2.U21(GND) U3#2.V9(GNDANA) U3#2.V13(GND) Y1.2(GND) Y1.4(GND)
VDDBU: C59.2 R21.2 R28.2 U3#2.E8(VBAT)
VDDCORE: C24.2 C25.2 C26.2 C27.2 C28.2 C30.2 C31.2 C32.2 C33.2 C34.2 C35.2 C36.2 C37.2 C38.2 C39.2 C40.2 U3#2.B2(VDDCORE) U3#2.F6(VDDCORE) U3#2.F15(VDDCORE) U3#2.H3(VDDCORE) U3#2.J9(VDDCORE) U3#2.J13(VDDCORE) U3#2.J16(VDDCORE) U3#2.N13(VDDCORE) U3#2.N16(VDDCORE) U3#2.T15(VDDCORE) U3#2.U16(VDDCORE) U3#2.U17(VDDCORE) U3#2.U19(VDDCORE) U3#2.V19(VDDCORE)
VDDCPU: C18.2 C19.2 C20.2 C21.2 C22.2 C23.2 U3#2.B20(VDDCPU) U3#2.E16(VDDCPU) U3#2.E17(VDDCPU) U3#2.E19(VDDCPU) U3#2.F17(VDDCPU)
VDDOUT25: C52.2 C53.2 C54.2 C55.2 C56.2 C57.2 C58.2 U3#2.D2(ADVREFP) U3#2.E3(VDDOUT25) U3#2.E5(VDDANA) U3#2.J6(VDDANA) U3#2.T16(VDDDPHY) U3#2.W11(VDDLVDS) U3#2.W14(VDDIN25)
EXP_2_IF_USB_N: U3#2.G1(HHSDMB) ; port EXP_2_IF_USB_N
EXP_2_IF_USB_P: U3#2.G2(HHSDPB) ; port EXP_2_IF_USB_P
HHSRTUNE: R20.1 U3#2.K7(HHSRTUNE)
IF_2_SW_USB_N: U3#2.F1(HHSDMA) ; port IF_2_SW_USB_N
IF_2_SW_USB_P: U3#2.F2(HHSDPA) ; port IF_2_SW_USB_P
LPM: U3#2.A6(LPM) ; port LPM
MIPI_REXT: R27.1 U3#2.V18(MIPI_REXT)
NRST: C29.1 R18#2.2 U3#2.D3(NRST) ; port NRST
NRST_OUT: R19.2 U3#2.E4(NRST_OUT) ; port NRST_OUT
QSPI0_CAL: R23.2 U3#2.M13(QSPI0_CAL)
SDMMC0_CAL: R24.2 U3#2.R16(SDMMC0_CAL)
SDMMC1_CAL: R25.2 U3#2.B13(SDMMC1_CAL)
SDMMC2_CAL: R26.2 U3#2.E14(SDMMC2_CAL)
SHDN: U3#2.B4(SHDN) ; port SHDN
WKUP: U3#2.A8(WKUP0) ; port WKUP
XIN24M: C60.1 R29.2 U3#2.B7(XIN) Y1.1(Osc1)
XIN32K: C62.1 R30.2 U3#2.A9(XIN32) Y2.1(Osc1)
XOUT24M: C61.1 R29.1 U3#2.A7(XOUT) Y1.3(Osc2)
XOUT32K: C63.1 R30.1 U3#2.B9(XOUT32) Y2.2(Osc2)
NetR21_1: R21.1 R22.2 U3#2.H10(JTAGSEL)

Not connected (* = marked no-connect by the designer): U3#2 J1(HHSDMC) J2(HHSDPC) K8(AUDIOCLK)* R20(MIPI_D3_N)* R21(MIPI_D3_P)* T20(MIPI_D2_N)* T21(MIPI_D2_P)* V20(MIPI_CLK_N)* V21(MIPI_CLK_P)* W20(MIPI_D1_N)* W21(MIPI_D1_P)* Y20(MIPI_D0_N)* Y21(MIPI_D0_P)*

### Layout directives
differential pair; differential pair class DIFF90; net class DIFF90; rule Matched Net Lengths [Tolerance = 4mil]: EXP_2_IF_USB_N, EXP_2_IF_USB_P, IF_2_SW_USB_N, IF_2_SW_USB_P

### Notes on the sheet
- SAMA7D65 SoC
- 90Ω ±15% differential trace impedance
  Routing top or bottom
- Project:
- BEE-1012
- Sub-system:
- SATELLITE_EXP_CONTROLLER
- Design by:
- SANG HUYNH
- BAO BUI
- Sheet title:
- Sheet
- A3
- of
- Checked by:
- Approved by:
- VU PHAM
- Revision:
- Document No:
- Size:
- Date:

### Library data of the parts
C18-C63 = _CAP_C_2: CAP CHIP
R18#2 R19-R30 = _RES_B_2: RES
U3#2 = SAMA7D65: SAMA7D65 MPU 1000MHz Cortex-A7 TFBGA-343; Manufacturer 1: Microchip Technology; Description_: MCHP MPU 32-BIT Cortex-A7 1000MHz 128kB SAMA7D65-V/4HB-SL3 TFBGA-343; Populated: YES; MCHP-ID: IC2674; Symbol: SAMA7D65-TFBGA-343; Dev Tools Status: Design; Owner: Ciprian Abramov; Restricted Sourcing: No; Manufacturer Part Number 1: SAMA7D65-V/4HB-SL3; Type: 32-Bit MPU; Status: MCL Design; Revision: 1; Category: MCHP-Microcontroller; ComponentLink1URL: https://www.microchip.com/sitesearch/search/Product%20and%20Development%20Tools/SAMA7D65-V/4HB-SL3; ComponentLink1Description: SVN Datasheet; ComponentLink2Description: Local Datasheet; ComponentLink3URL: C:\ALTIUM_WORK\00001_MCHP-CDB\Library\LibraryRefs\SAMA7D65-TFBGA-343.SchLib; ComponentLink3Description: Open Symbol; ComponentLink4URL: C:\ALTIUM_WORK\00001_MCHP-CDB\Library\Footprints\TFBGA-343_14x14.PcbLib; ComponentLink4Description: Open Footprint; ComponentLink5Description: Open Footprint 2; ComponentLink6Description: Open Footprint 3; ComponentLink7Description: Open Footprint 4; Supplier 1: Microchip Technology; Supplier Part Number 1: SAMA7D65-V/4HB-SL3; Operating Temperature: -40C to +105C; Quantity Override: 1
Y1 = ECS-240-10-37B2-JTN-TR: CRYSTAL 24 MHZ 10PF SMD; Manufacturer 1: ECS Inc; MCHP-ID: OSC1299; Description_: CRYSTAL 24MHz 10pF SMD L2W1.6H0.5; Dev Tools Status: Design; Owner: Ciprian Abramov; Tolerance: 20ppm; Populated: YES; Revision: 1; Symbol: Crystal 4 Pins; Status: MCL Design; ComponentLink1URL: https://chn-vm-apps.microchip.com/mchprepo/parts/Datasheets/ECX-1637B2.pdf; ComponentLink1Description: SVN Datasheet; ComponentLink2URL: C:\ALTIUM_WORK\00001_MCHP-CDB\Datasheets\ECX-1637B2.pdf; ComponentLink2Description: Local Datasheet; ComponentLink3URL: C:\ALTIUM_WORK\00001_MCHP-CDB\Library\LibraryRefs\Crystal 4 Pins.SchLib; ComponentLink3Description: Open Symbol; ComponentLink4URL: C:\ALTIUM_WORK\00001_MCHP-CDB\Library\Footprints\CRYSTAL_L2.0W1.6H0.5_FA-128.PcbLib; ComponentLink4Description: Open Footprint; ComponentLink5Description: Open Footprint 2; ComponentLink6Description: Open Footprint 3; ComponentLink7Description: Open Footprint 4; Operating Temperature: -40C to +85C; Package: L2.0W1.6H0.5; Type: Crystal; Category: Crystal/Oscillator; Load Capacitance: 10pF; Manufacturer Part Number 1: ECS-240-10-37B2-JTN-TR; Supplier 1: Digi-Key; Supplier Part Number 1: 50-ECS-240-10-37B2-JTN-TR-ND; Quantity Override: 1
Y2 = FC-12M 32.7680KA-A3: CRYSTAL 32.7680KHZ 12.5PF SMD; Manufacturer 1: Epson; MCHP-ID: OSC1269; Description_: CRYSTAL 32.768KHZ 12.5PF SMD 2-SMD, No Lead, FC-12M 32.7680KA-A3; Dev Tools Status: Design; Owner: Dragos Danaila; Tolerance: 20ppm; Populated: YES; Revision: 1; Symbol: Crystal 2 Pins; Status: MCL Design; ComponentLink1URL: https://chn-vm-apps.microchip.com/mchprepo/parts/Datasheets/FC-12D_en.pdf; ComponentLink1Description: SVN Datasheet; ComponentLink2URL: C:\ALTIUM_WORK\00001_MCHP-CDB\Datasheets\FC-12D_en.pdf; ComponentLink2Description: Local Datasheet; ComponentLink3URL: C:\ALTIUM_WORK\00001_MCHP-CDB\Library\LibraryRefs\Crystal 2 Pins.SchLib; ComponentLink3Description: Open Symbol; ComponentLink4URL: C:\ALTIUM_WORK\00001_MCHP-CDB\Library\Footprints\CRYSTAL_FC-12M_L2.05W1.2H0.6.PcbLib; ComponentLink4Description: Open Footprint; ComponentLink5Description: Open Footprint 2; ComponentLink6Description: Open Footprint 3; ComponentLink7Description: Open Footprint 4; Operating Temperature: -40°C ~ 85°C; Package: 2-SMD, No Lead; Type: Crystal; Category: Crystal/Oscillator; Manufacturer Part Number 1: FC-12M 32.7680KA-A3; Supplier 1: Digikey; Supplier Part Number 1: SER3672CT-ND; Quantity Override: 1